# Altium project Leningrad.PrjPcb (part 1 of 2)
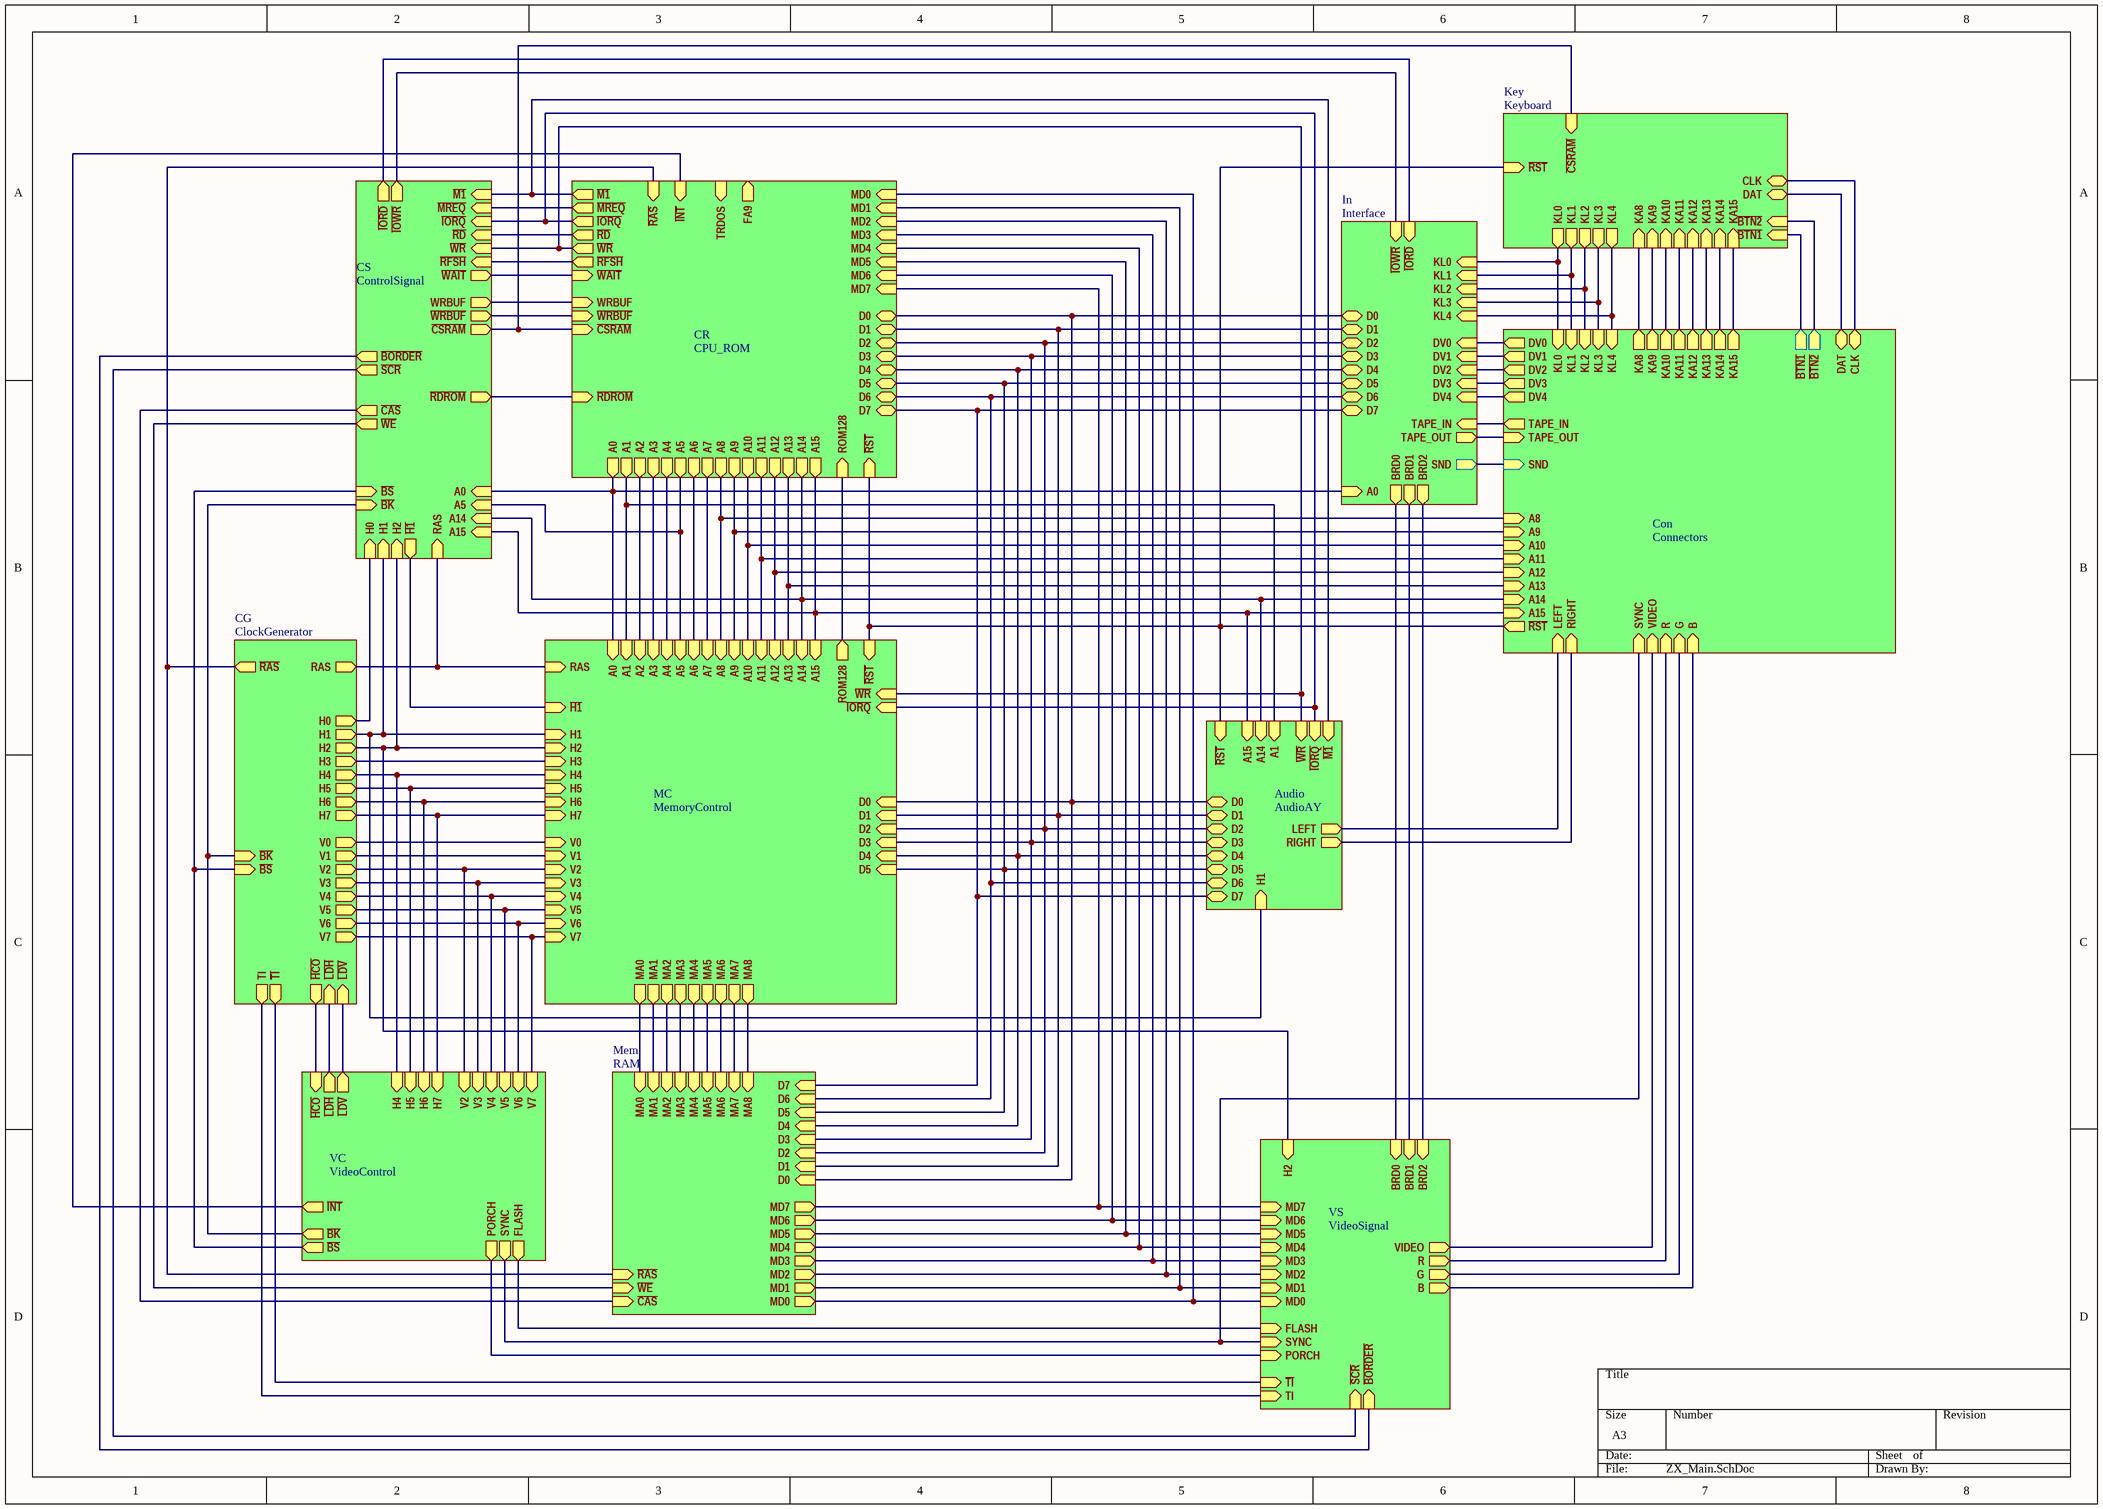
[diagram p0: ZX_Main.SchDoc]
12 sheets, 250 parts. Net scope: hierarchical (ports join the sheet entries above them; power ports are global).
Board file: Leningrad_modify.PcbDoc
Sheets:
  ZX_Main.SchDoc
    CG = ClockGenerator.SchDoc
    CS = ControlSignal.SchDoc
    VC = VideoControl.SchDoc
    VS = VideoSignal.SchDoc
    CR = CPU_ROM.SchDoc
    MC = MemoryControl.SchDoc
    Mem = RAM.SchDoc
    Key = Keyboard.SchDoc
    Audio = AudioAY.SchDoc
    In = Interface.SchDoc
    Con = Connectors.SchDoc

## Sheet ZX_Main.SchDoc
size A3

### Sub-sheets
Audio = AudioAY: A15 (in), ~{IORQ} (in), ~{WR} (in), A14 (in), A1 (in), ~{M1} (in), D5 (bidir), D0 (bidir), D6 (bidir), D7 (bidir), D4 (bidir), D3 (bidir), D2 (bidir), D1 (bidir), H1 (in), ~{RST} (in), RIGHT (out), LEFT (out)
CG = ClockGenerator: TI (out), H5 (out), ~{HCO} (out), V5 (out), V4 (out), V7 (out), V0 (out), H2 (out), H0 (out), ~{LDH} (in), H7 (out), ~{RAS} (out), V3 (out), H1 (out), H3 (out), V2 (out), V6 (out), ~{TI} (out), H6 (out), H4 (out), ~{LDV} (in), RAS (out), ~{BK} (in), ~{BS} (in), V1 (out)
Con = Connectors: VIDEO (in), B (in), G (in), R (in), KA14 (out), SYNC (in), ~{RST} (out), LEFT (in), RIGHT (in), DAT (bidir), CLK (bidir), TAPE_IN (out), TAPE_OUT (in), KA15 (out), KA10 (out), KA12 (out), KA11 (out), KA13 (out), KA9 (out), A9 (in), A15 (in), A8 (in), A13 (in), A14 (in), A12 (in), A11 (in), A10 (in), KA8 (out), DV0 (out), DV1 (out), DV4 (out), DV3 (out), DV2 (out), ~{BTN1} (out), ~{BTN2} (out), KL0 (in), KL4 (in), KL1 (in), KL3 (in), KL2 (in), SND (in)
CR = CPU_ROM: ~{RD} (out), ~{WAIT} (in), A0 (out), ~{RDROM} (in), ~{RAS} (in), ~{M1} (out), ~{INT} (in), ~{RFSH} (out), ~{WR} (out), ~{MREQ} (out), ~{RST} (in), MD7 (in), MD6 (in), MD5 (in), MD4 (in), MD3 (in), MD2 (in), MD1 (in), MD0 (in), ~{WRBUF} (in), WRBUF (in), ~{CSRAM} (in), FA9 (out), ~{IORQ} (out), TRDOS (in), ROM128 (in), D7 (bidir), D6 (bidir), D5 (bidir), D4 (bidir), D3 (bidir), D2 (bidir), D1 (bidir), D0 (bidir), A15 (out), A14 (out), A13 (out), A12 (out), A11 (out), A10 (out), A9 (out), A8 (out), A7 (out), A6 (out), A2 (out), A1 (out), A5 (out), A4 (out), A3 (out)
CS = ControlSignal: ~{BS} (in), ~{BK} (in), H0 (in), H1 (in), H2 (in), ~{BORDER} (out), ~{SCR} (out), ~{CAS} (out), ~{WRBUF} (out), WRBUF (out), ~{RD} (in), ~{RFSH} (in), RAS (in), ~{H1} (out), ~{MREQ} (in), A14 (in), A15 (in), ~{WE} (out), ~{RDROM} (out), ~{CSRAM} (out), ~{M1} (in), ~{WAIT} (out), A0 (in), A5 (in), ~{IORQ} (in), ~{WR} (in), ~{IORD} (out), ~{IOWR} (out)
In = Interface: A0 (in), ~{IORD} (in), KL0 (in), KL1 (in), KL2 (in), KL3 (in), KL4 (in), DV0 (in), DV1 (in), DV2 (in), D0, D1, D2, DV3 (in), DV4 (in), D3, D4, D5, D6, D7, ~{IOWR} (in), BRD0 (out), BRD1 (out), BRD2 (out), TAPE_IN (in), TAPE_OUT (out), SND (out)
Key = Keyboard: KA13 (in), ~{CSRAM} (in), KA15 (in), KL2 (out), ~{RST} (in), KA12 (in), KL3 (out), KA14 (in), KL4 (out), KA8 (in), KA11 (in), CLK (bidir), ~{BTN1} (in), KA10 (in), KA9 (in), DAT (bidir), ~{BTN2} (in), KL0 (out), KL1 (out)
MC = MemoryControl: MA1 (out), MA0 (out), MA8 (out), V4 (in), MA4 (out), MA3 (out), RAS (in), V2 (in), ~{H1} (in), MA7 (out), A1 (in), H5 (in), V1 (in), H1 (in), H2 (in), V3 (in), MA6 (out), V0 (in), MA5 (out), V7 (in), V6 (in), H6 (in), MA2 (out), V5 (in), A0 (in), H7 (in), H4 (in), H3 (in), A2 (in), A3 (in), A4 (in), A5 (in), A6 (in), A7 (in), A8 (in), A9 (in), A10 (in), A11 (in), A12 (in), A13 (in), A14 (in), A15 (in), ~{RST} (in), D0 (in), D1 (in), D2 (in), D3 (in), D4 (in), D5 (in), ~{WR} (in), ~{IORQ} (in), ROM128 (out)
Mem = RAM: D6 (in), D1 (in), D0 (in), MD0 (out), D4 (in), MD7 (out), D7 (in), D5 (in), MD3 (out), MD1 (out), D2 (in), D3 (in), MD2 (out), MD4 (out), MD5 (out), MD6 (out), ~{WE} (in), ~{CAS} (in), ~{RAS} (in), MA8 (in), MA7 (in), MA6 (in), MA5 (in), MA4 (in), MA2 (in), MA1 (in), MA0 (in), MA3 (in)
VC = VideoControl: H7 (in), H6 (in), H5 (in), ~{HCO} (in), ~{LDH} (out), ~{BS} (out), PORCH (out), SYNC (out), V4 (in), V7 (in), ~{LDV} (out), H4 (in), V5 (in), V6 (in), V2 (in), V3 (in), ~{BK} (out), FLASH (out), ~{INT} (out)
VS = VideoSignal: H2 (in), MD6 (in), SYNC (in), MD5 (in), MD3 (in), MD1 (in), TI (in), ~{SCR} (in), FLASH (in), ~{TI} (in), MD0 (in), MD2 (in), MD4 (in), PORCH (in), ~{BORDER} (in), MD7 (in), G (out), R (out), B (out), VIDEO (out), BRD2 (in), BRD1 (in), BRD0 (in)

### Nets
A0: sheet CS/A0, sheet CR/A0, sheet MC/A0, sheet In/A0
A1: sheet CR/A1, sheet MC/A1, sheet Audio/A1
A2: sheet CR/A2, sheet MC/A2
A3: sheet CR/A3, sheet MC/A3
A4: sheet CR/A4, sheet MC/A4
A5: sheet CS/A5, sheet CR/A5, sheet MC/A5
A6: sheet CR/A6, sheet MC/A6
A7: sheet CR/A7, sheet MC/A7
A8: sheet CR/A8, sheet MC/A8, sheet Con/A8
A9: sheet CR/A9, sheet MC/A9, sheet Con/A9
A10: sheet CR/A10, sheet MC/A10, sheet Con/A10
A11: sheet CR/A11, sheet MC/A11, sheet Con/A11
A12: sheet CR/A12, sheet MC/A12, sheet Con/A12
A13: sheet CR/A13, sheet MC/A13, sheet Con/A13
A14: sheet CS/A14, sheet CR/A14, sheet MC/A14, sheet Audio/A14, sheet Con/A14
A15: sheet CS/A15, sheet CR/A15, sheet MC/A15, sheet Audio/A15, sheet Con/A15
~{BORDER}: sheet CS/~{BORDER}, sheet VS/~{BORDER}
BRD0: sheet VS/BRD0, sheet In/BRD0
BRD1: sheet VS/BRD1, sheet In/BRD1
BRD2: sheet VS/BRD2, sheet In/BRD2
~{CAS}: sheet CS/~{CAS}, sheet Mem/~{CAS}
D0: sheet CR/D0, sheet MC/D0, sheet Mem/D0, sheet Audio/D0, sheet In/D0
D1: sheet CR/D1, sheet MC/D1, sheet Mem/D1, sheet Audio/D1, sheet In/D1
D2: sheet CR/D2, sheet MC/D2, sheet Mem/D2, sheet Audio/D2, sheet In/D2
D3: sheet CR/D3, sheet MC/D3, sheet Mem/D3, sheet Audio/D3, sheet In/D3
D4: sheet CR/D4, sheet MC/D4, sheet Mem/D4, sheet Audio/D4, sheet In/D4
D5: sheet CR/D5, sheet MC/D5, sheet Mem/D5, sheet Audio/D5, sheet In/D5
D6: sheet CR/D6, sheet Mem/D6, sheet Audio/D6, sheet In/D6
D7: sheet CR/D7, sheet Mem/D7, sheet Audio/D7, sheet In/D7
DV0: sheet In/DV0, sheet Con/DV0
DV1: sheet In/DV1, sheet Con/DV1
DV2: sheet In/DV2, sheet Con/DV2
DV3: sheet In/DV3, sheet Con/DV3
DV4: sheet In/DV4, sheet Con/DV4
H0: sheet CG/H0, sheet CS/H0
H1: sheet CG/H1, sheet CS/H1, sheet MC/H1, sheet Audio/H1
H2: sheet CG/H2, sheet CS/H2, sheet VS/H2, sheet MC/H2
H5: sheet CG/H5, sheet VC/H5, sheet MC/H5
~{H1}: sheet CS/~{H1}, sheet MC/~{H1}
~{IORD}: sheet CS/~{IORD}, sheet In/~{IORD}
KL0: sheet Key/KL0, sheet In/KL0, sheet Con/KL0
KL1: sheet Key/KL1, sheet In/KL1, sheet Con/KL1
KL2: sheet Key/KL2, sheet In/KL2, sheet Con/KL2
KL3: sheet Key/KL3, sheet In/KL3, sheet Con/KL3
KL4: sheet Key/KL4, sheet In/KL4, sheet Con/KL4
~{MREQ}: sheet CS/~{MREQ}, sheet CR/~{MREQ}
MA0: sheet MC/MA0, sheet Mem/MA0
MA1: sheet MC/MA1, sheet Mem/MA1
MA2: sheet MC/MA2, sheet Mem/MA2
MA3: sheet MC/MA3, sheet Mem/MA3
MA4: sheet MC/MA4, sheet Mem/MA4
MA5: sheet MC/MA5, sheet Mem/MA5
MA6: sheet MC/MA6, sheet Mem/MA6
MA7: sheet MC/MA7, sheet Mem/MA7
MA8: sheet MC/MA8, sheet Mem/MA8
MD0: sheet VS/MD0, sheet CR/MD0, sheet Mem/MD0
MD1: sheet VS/MD1, sheet CR/MD1, sheet Mem/MD1
MD2: sheet VS/MD2, sheet CR/MD2, sheet Mem/MD2
MD3: sheet VS/MD3, sheet CR/MD3, sheet Mem/MD3
MD4: sheet VS/MD4, sheet CR/MD4, sheet Mem/MD4
MD5: sheet VS/MD5, sheet CR/MD5, sheet Mem/MD5
MD6: sheet VS/MD6, sheet CR/MD6, sheet Mem/MD6
MD7: sheet VS/MD7, sheet CR/MD7, sheet Mem/MD7
~{RAS}: sheet CG/~{RAS}, sheet CR/~{RAS}, sheet Mem/~{RAS}
~{RD}: sheet CS/~{RD}, sheet CR/~{RD}
RAS: sheet CG/RAS, sheet CS/RAS, sheet MC/RAS
V4: sheet CG/V4, sheet VC/V4, sheet MC/V4
V5: sheet CG/V5, sheet VC/V5, sheet MC/V5
V6: sheet CG/V6, sheet VC/V6, sheet MC/V6
~{WE}: sheet CS/~{WE}, sheet Mem/~{WE}
~{WR}: sheet CS/~{WR}, sheet CR/~{WR}, sheet MC/~{WR}, sheet Audio/~{WR}
~{WRBUF}: sheet CS/~{WRBUF}, sheet CR/~{WRBUF}
NetB_1: sheet VS/B, sheet Con/B
NetBTN1_1: sheet Key/~{BTN1}, sheet Con/~{BTN1}
NetBTN2_1: sheet Key/~{BTN2}, sheet Con/~{BTN2}
NetC1_1: sheet CR/~{RST}, sheet MC/~{RST}, sheet Key/~{RST}, sheet Audio/~{RST}, sheet Con/~{RST}
NetC10_2: sheet CG/~{HCO}, sheet VC/~{HCO}
NetC11_1: sheet CG/~{LDV}, sheet VC/~{LDV}
NetC12_2: sheet CG/~{BS}, sheet CS/~{BS}, sheet VC/~{BS}
NetC24_1: sheet In/TAPE_OUT, sheet Con/TAPE_OUT
NetC46_1: sheet In/TAPE_IN, sheet Con/TAPE_IN
NetC52_2: sheet Audio/LEFT, sheet Con/LEFT
NetC53_2: sheet Audio/RIGHT, sheet Con/RIGHT
NetD2_2: sheet VC/FLASH, sheet VS/FLASH
NetD4_2: sheet VC/SYNC, sheet VS/SYNC, sheet Con/SYNC
NetD10_1: sheet Key/KA8, sheet Con/KA8
NetD11_1: sheet Key/KA9, sheet Con/KA9
NetD12_1: sheet Key/KA10, sheet Con/KA10
NetD13_1: sheet Key/KA11, sheet Con/KA11
NetD14_1: sheet Key/KA12, sheet Con/KA12
NetD15_1: sheet Key/KA13, sheet Con/KA13
NetD16_1: sheet Key/KA14, sheet Con/KA14
NetD17_1: sheet Key/KA15, sheet Con/KA15
NetG_1: sheet VS/G, sheet Con/G
NetJ6_2: sheet CS/~{IOWR}, sheet In/~{IOWR}
NetJ8_3: sheet VS/VIDEO, sheet Con/VIDEO
NetJ11_1: sheet CS/WRBUF, sheet CR/WRBUF
NetJ14_2: sheet CS/~{IORQ}, sheet CR/~{IORQ}, sheet MC/~{IORQ}, sheet Audio/~{IORQ}
NetJ27_1: sheet CG/H7, sheet VC/H7, sheet MC/H7
NetJ28_2: sheet VC/PORCH, sheet VS/PORCH
NetQ1_2: sheet In/SND, sheet Con/SND
NetR25_2: sheet CS/~{SCR}, sheet VS/~{SCR}
NetR_1: sheet VS/R, sheet Con/R
NetU1_9: sheet CS/~{CSRAM}, sheet CR/~{CSRAM}, sheet Key/~{CSRAM}
NetU1_12: sheet VC/~{INT}, sheet CR/~{INT}
NetU2_2: sheet CG/~{TI}, sheet VS/~{TI}
NetU2_5: sheet CG/TI, sheet VS/TI
NetU3_7: sheet CG/H3, sheet MC/H3
NetU4_3: sheet CG/H4, sheet VC/H4, sheet MC/H4
NetU4_6: sheet CG/H6, sheet VC/H6, sheet MC/H6
NetU4_11: sheet CG/~{LDH}, sheet VC/~{LDH}
NetU5_2: sheet CG/V1, sheet MC/V1
NetU5_3: sheet CG/V0, sheet MC/V0
NetU5_6: sheet CG/V2, sheet VC/V2, sheet MC/V2
NetU5_7: sheet CG/V3, sheet VC/V3, sheet MC/V3
NetU5_9: sheet CG/~{BK}, sheet CS/~{BK}, sheet VC/~{BK}
NetU6_7: sheet CG/V7, sheet VC/V7, sheet MC/V7
NetU9_2: sheet CS/~{M1}, sheet CR/~{M1}, sheet Audio/~{M1}
NetU9_5: sheet CS/~{WAIT}, sheet CR/~{WAIT}
NetU12_3: sheet CS/~{RDROM}, sheet CR/~{RDROM}
NetU12_13: sheet CS/~{RFSH}, sheet CR/~{RFSH}
NetU34_9: sheet CR/ROM128, sheet MC/ROM128
NetU43_27: sheet Key/DAT, sheet Con/DAT
NetU43_28: sheet Key/CLK, sheet Con/CLK

## Sheet ClockGenerator.SchDoc
size A4
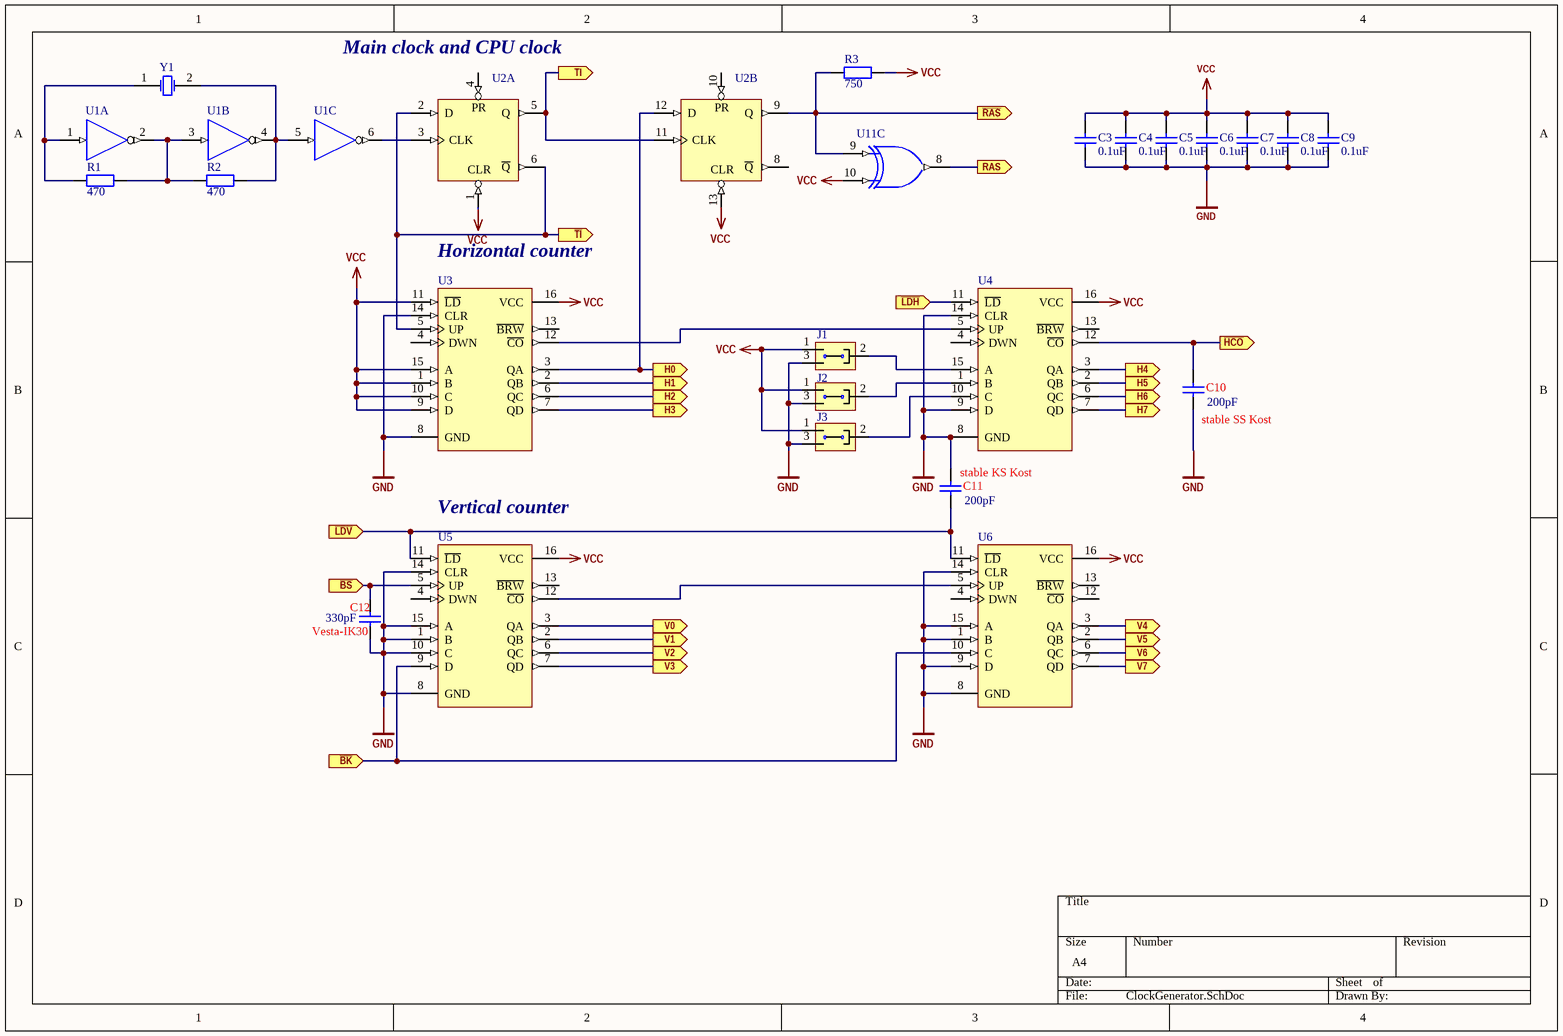
[diagram p1: ClockGenerator.SchDoc]

### Parts
C3  value 0.1uF  [RAD-0.3]  (hidden comment: Cap)
C4  value 0.1uF  [RAD-0.3]  (hidden comment: Cap)
C5  value 0.1uF  [RAD-0.3]  (hidden comment: Cap)
C6  value 0.1uF  [RAD-0.3]  (hidden comment: Cap)
C7  value 0.1uF  [RAD-0.3]  (hidden comment: Cap)
C8  value 0.1uF  [RAD-0.3]  (hidden comment: Cap)
C9  value 0.1uF  [RAD-0.3]  (hidden comment: Cap)
C10  stable SS Kost  value 200pF  [RAD-0.3]
C11  stable KS Kost  value 200pF  [RAD-0.3]
C12  Vesta-IK30  value 330pF  [RAD-0.3]
J1  Jump3  [MHDR1X3]  (value not drawn)
J2  Jump3  [MHDR1X3]  (value not drawn)
J3  Jump3  [MHDR1X3]  (value not drawn)
R1  value 470  [AXIAL-0.4]
R2  value 470  [AXIAL-0.4]
R3  value 750  [AXIAL-0.4]
U1  (no value)  [N014]  (parts A,B,C of 6)
U2  (no value)  [N014]  (parts A,B of 2)
U3  (no value)  [N016]
U4  (no value)  [N016]
U5  (no value)  [N016]
U6  (no value)  [N016]
U11  (no value)  [N014]  (part C of 4)
Y1  XTAL  [HC25U]  (value not drawn)

### Ports
H0 (out), H1 (out), H2 (out), H3 (out), H4 (out), H5 (out), H6 (out), H7 (out), RAS (out), TI (out), V0 (out), V1 (out), V2 (out), V3 (out), V4 (out), V5 (out), V6 (out), V7 (out), ~{BK} (in), ~{BS} (in), ~{HCO} (out), ~{LDH} (in), ~{LDV} (in), ~{RAS} (out), ~{TI} (out)

### Nets
GND: C3.1 C4.1 C5.1 C6.1 C7.1 C8.1 C9.1 C10.1 C11.2 C12.1 J1.3 J2.3 J3.3 U1.7(GND) U2.7(GND) U3.8(GND) U3.14(CLR) U4.8(GND) U4.9(D) U4.14(CLR) U5.1(B) U5.8(GND) U5.10(C) U5.14(CLR) U5.15(A) U6.1(B) U6.8(GND) U6.9(D) U6.14(CLR) U6.15(A) U11.7(GND)
VCC: C3.2 C4.2 C5.2 C6.2 C7.2 C8.2 C9.2 J1.1 J2.1 J3.1 R3.2 U1.14(VCC) U2.1(CLR) U2.13(CLR) U2.14(VCC) U3.1(B) U3.9(D) U3.10(C) U3.11(~{LD}) U3.15(A) U3.16(VCC) U4.16(VCC) U5.16(VCC) U6.16(VCC) U11.10(B) U11.14(VCC)
H0: U2.12(D) U3.3(QA) ; port H0
H1: U3.2(QB) ; port H1
H2: U3.6(QC) ; port H2
H5: U4.2(QB) ; port H5
~{RAS}: R3.1 U2.9(Q) U11.9(A) ; port ~{RAS}
RAS: U11.8(Y) ; port RAS
V4: U6.3(QA) ; port V4
V5: U6.2(QB) ; port V5
V6: U6.6(QC) ; port V6
NetC10_2: C10.2 U4.12(~{CO}) ; port ~{HCO}
NetC11_1: C11.1 U5.11(~{LD}) U6.11(~{LD}) ; port ~{LDV}
NetC12_2: C12.2 U5.5(UP) ; port ~{BS}
NetJ1_2: J1.2 U4.15(A)
NetJ2_2: J2.2 U4.1(B)
NetJ3_2: J3.2 U4.10(C)
NetJ27_1: U4.7(QD) ; port H7
NetR1_1: R1.1 U1.1(A) Y1.1(OSC1)
NetR1_2: R1.2 R2.1 U1.2(Y) U1.3(A)
NetR2_2: R2.2 U1.4(Y) U1.5(A) Y1.2(OSC2)
NetU1_6: U1.6(Y) U2.3(CLK)
NetU2_2: U2.2(D) U2.6(~{Q}) U3.5(UP) ; port ~{TI}
NetU2_5: U2.5(Q) U2.11(CLK) ; port TI
NetU3_7: U3.7(QD) ; port H3
NetU3_12: U3.12(~{CO}) U4.5(UP)
NetU4_3: U4.3(QA) ; port H4
NetU4_6: U4.6(QC) ; port H6
NetU4_11: U4.11(~{LD}) ; port ~{LDH}
NetU5_2: U5.2(QB) ; port V1
NetU5_3: U5.3(QA) ; port V0
NetU5_6: U5.6(QC) ; port V2
NetU5_7: U5.7(QD) ; port V3
NetU5_9: U5.9(D) U6.10(C) ; port ~{BK}
NetU5_12: U5.12(~{CO}) U6.5(UP)
NetU6_7: U6.7(QD) ; port V7

Not connected (* = marked no-connect by the designer): U2 4(PR) 8(~{Q}) 10(PR); U3 4(DWN) 13(~{BRW}); U4 4(DWN) 13(~{BRW}); U5 4(DWN) 13(~{BRW}); U6 4(DWN) 12(~{CO}) 13(~{BRW})

### Notes on the sheet
- (near U2) Main clock and CPU clock
- Horizontal counter
- Vertical counter

### Library data of the parts
C3-C12 = Cap: Capacitor; Published: 8-Jun-2000; LatestRevisionDate: 17-Jul-2002; LatestRevisionNote: Re-released for DXP Platform.; PackageReference: RAD-0.3; Publisher: Altium Limited; PackageDescription: Radial Cap, Thru-Hole; 2 Leads; 0.3 in Pin Spacing
R1-R3 = Res2: Resistor; Published: 8-Jun-2000; LatestRevisionDate: 17-Jul-2002; LatestRevisionNote: Re-released for DXP Platform.; PackageReference: AXIAL-0.4; Publisher: Altium Limited; PackageDescription: Axial Device, Thru-Hole; 2 Leads; 0.4 in Pin Spacing
U1 = SN74HC04N: Hex Inverter; Published: 8-Jun-2000; LatestRevisionDate: 04-Mar-2005; LatestRevisionNote: Stylized 3D Model Added.; DatasheetVersion: May-1997; PackageVersion: Oct-1995; PackageReference: N014; Publisher: Altium Limited; PackageDescription: DIP; 14 Leads; Row Spacing 7.62 mm; Pitch 2.54 mm; ComponentLink1Description: Manufacturer Link; ComponentLink1URL: http://www.ti.com/; ComponentLink2Description: Datasheet; ComponentLink2URL: http://www-s.ti.com/sc/ds/sn74hc04.pdf
U2 = SN74HC74N: Dual D-Type Positive-Edge-Triggered Flip-Flop with Clear and Preset; Published: 8-Jun-2000; LatestRevisionDate: 04-Mar-2005; LatestRevisionNote: Stylized 3D Model Added.; DatasheetVersion: May-1997; PackageVersion: Oct-1995; PackageReference: N014; Publisher: Altium Limited; PackageDescription: DIP; 14 Leads; Row Spacing 7.62 mm; Pitch 2.54 mm; ComponentLink1Description: Manufacturer Link; ComponentLink1URL: http://www.ti.com/; ComponentLink2Description: Datasheet; ComponentLink2URL: http://www-s.ti.com/sc/ds/sn74hc74.pdf
U3-U6 = SN74HC193N: 4-Bit Synchronous Up/Down Counter (Dual Clock with Clear); Published: 8-Jun-2000; LatestRevisionDate: 04-Mar-2005; LatestRevisionNote: Stylized 3D Model Added.; DatasheetVersion: May-1997; PackageVersion: Oct-1995; PackageReference: N016; Publisher: Altium Limited; PackageDescription: DIP; 16 Leads; Row Spacing 7.62 mm; Pitch 2.54 mm; Code_JEDEC: MS-001-BB; ComponentLink1Description: Manufacturer Link; ComponentLink1URL: http://www.ti.com/; ComponentLink2Description: Datasheet; ComponentLink2URL: http://www-s.ti.com/sc/ds/sn74hc193.pdf
U11 = SN74HC86N: Quadruple 2-Input Exclusive-OR Gate; Published: 8-Jun-2000; LatestRevisionDate: 04-Mar-2005; LatestRevisionNote: Stylized 3D Model Added.; DatasheetVersion: Aug-1999; PackageVersion: Oct-1995; PackageReference: N014; Publisher: Altium Limited; PackageDescription: DIP; 14 Leads; Row Spacing 7.62 mm; Pitch 2.54 mm; ComponentLink1Description: Manufacturer Link; ComponentLink1URL: http://www.ti.com/; ComponentLink2Description: Datasheet; ComponentLink2URL: http://www-s.ti.com/sc/ds/SN54HC86.pdf
Y1 = XTAL: Crystal Oscillator; Published: 8-Jun-2000; LatestRevisionDate: 17-Jul-2002; LatestRevisionNote: Re-released for DXP Platform.; PackageReference: R38; Publisher: Altium Limited; PackageDescription: Crystal, Thru-Hole; 2 Leads; Body 3.1 x 8.2 mm (Dia.xH)

## Sheet ControlSignal.SchDoc
size A4
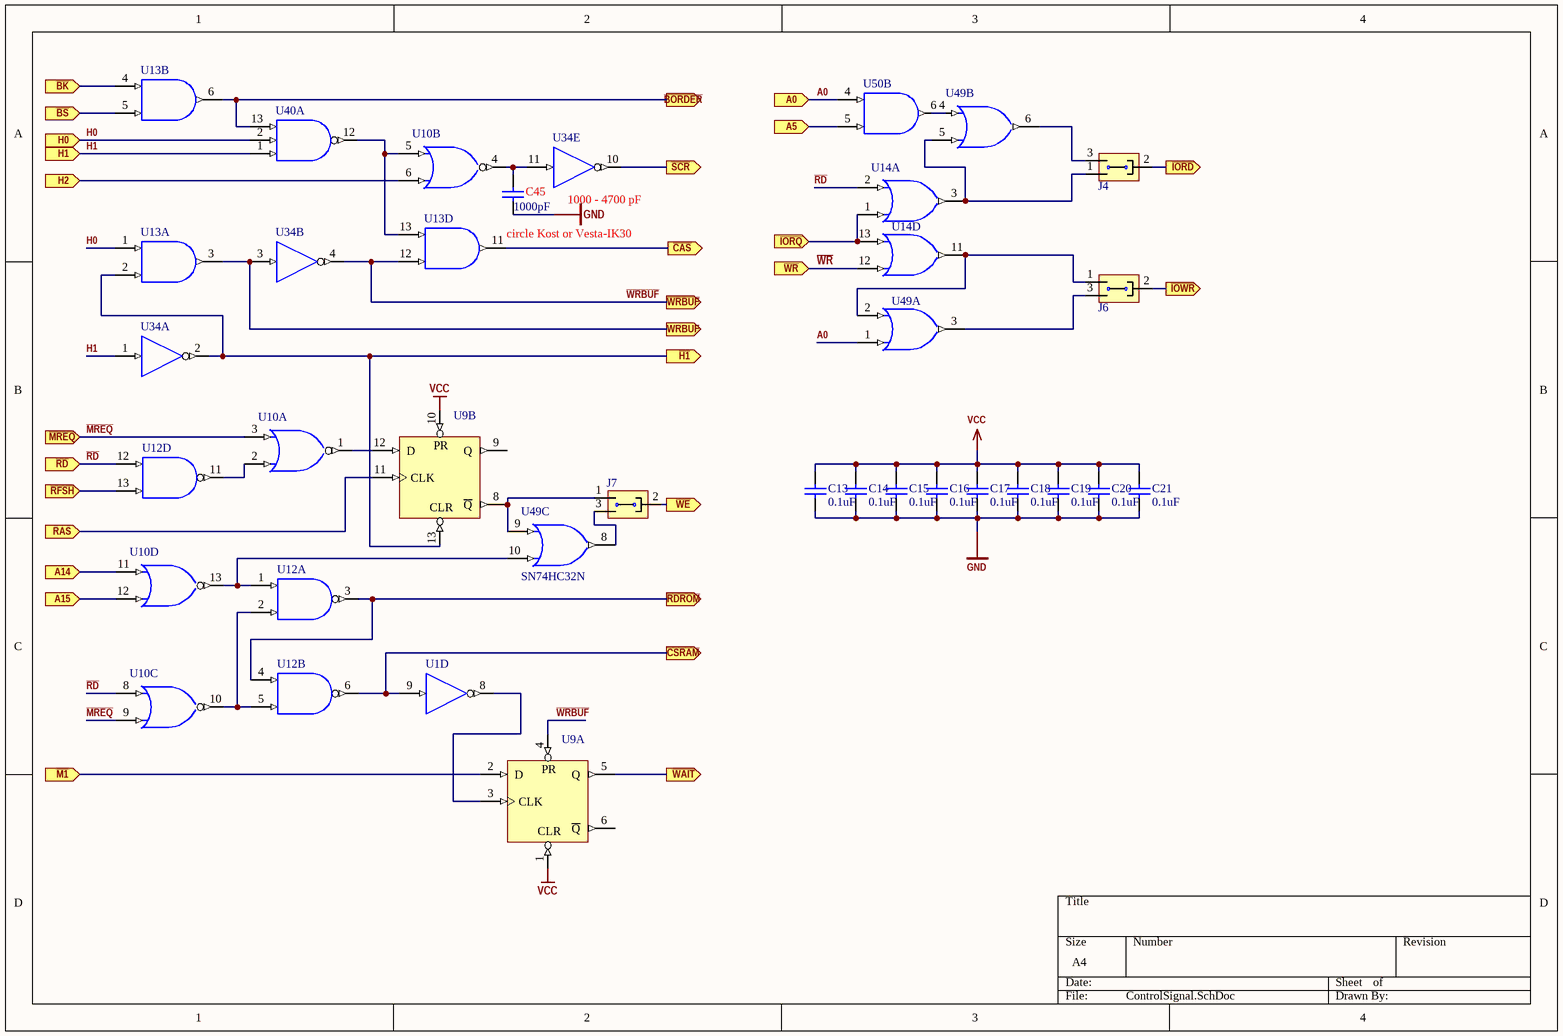
[diagram p2: ControlSignal.SchDoc]

### Parts
C13  value 0.1uF  [RAD-0.3]  (hidden comment: Cap)
C14  value 0.1uF  [RAD-0.3]  (hidden comment: Cap)
C15  value 0.1uF  [RAD-0.3]  (hidden comment: Cap)
C16  value 0.1uF  [RAD-0.3]  (hidden comment: Cap)
C17  value 0.1uF  [RAD-0.3]  (hidden comment: Cap)
C18  value 0.1uF  [RAD-0.3]  (hidden comment: Cap)
C19  value 0.1uF  [RAD-0.3]  (hidden comment: Cap)
C20  value 0.1uF  [RAD-0.3]  (hidden comment: Cap)
C21  value 0.1uF  [RAD-0.3]  (hidden comment: Cap)
C45  circle Kost or Vesta-IK30  value 1000pF  [RAD-0.3]
J4  Jump3  [MHDR1X3]  (value not drawn)
J6  Jump3  [MHDR1X3]  (value not drawn)
J7  Jump3  [MHDR1X3]  (value not drawn)
U1  (no value)  [N014]  (part D of 6)
U9  (no value)  [N014]  (parts A,B of 2)
U10  (no value)  [N014]  (parts A,B,C,D of 4)
U12  (no value)  [N014]  (parts A,B,D of 4)
U13  (no value)  [N014]  (parts A,B,D of 4)
U14  (no value)  [N014]  (parts A,D of 4)
U34  (no value)  [N014]  (parts A,B,E of 6)
U40  (no value)  [N014]  (part A of 3)
U49  SN74HC32N  [N014]  (value not drawn)  (parts A,B,C of 4)
U50  SN74HC08N  [N014]  (value not drawn)  (part B of 4)

### Ports
A0 (in), A5 (in), A14 (in), A15 (in), H0 (in), H1 (in), H2 (in), RAS (in), WRBUF (out), ~{BK} (in), ~{BORDER} (out), ~{BS} (in), ~{CAS} (out), ~{CSRAM} (out), ~{H1} (out), ~{IORD} (out), ~{IORQ} (in), ~{IOWR} (out), ~{M1} (in), ~{MREQ} (in), ~{RDROM} (out), ~{RD} (in), ~{RFSH} (in), ~{SCR} (out), ~{WAIT} (out), ~{WE} (out), ~{WRBUF} (out), ~{WR} (in)

### Nets
GND: C13.1 C14.1 C15.1 C16.1 C17.1 C18.1 C19.1 C20.1 C21.1 C45.1 U1.7(GND) U9.7(GND) U10.7(GND) U12.7(GND) U13.7(GND) U14.7(GND) U34.7(GND) U40.7(GND) U49.7(GND) U50.7(GND)
VCC: C13.2 C14.2 C15.2 C16.2 C17.2 C18.2 C19.2 C20.2 C21.2 U1.14(VCC) U9.1(CLR) U9.10(PR) U9.14(VCC) U10.14(VCC) U12.14(VCC) U13.14(VCC) U14.14(VCC) U34.14(VCC) U40.14(VCC) U49.14(VCC) U50.14(VCC)
A0: U49.1(A) U50.4(A) ; port A0
A5: U50.5(B) ; port A5
A14: U10.11(A) ; port A14
A15: U10.12(B) ; port A15
~{BORDER}: U13.6(Y) U40.13(C) ; port ~{BORDER}
~{CAS}: U13.11(Y) ; port ~{CAS}
H0: U13.1(A) U40.2(B) ; port H0
H1: U34.1(A) U40.1(A) ; port H1
H2: U10.6(B) ; port H2
~{H1}: U9.13(CLR) U13.2(B) U34.2(Y) ; port ~{H1}
~{IORD}: J4.2 ; port ~{IORD}
~{MREQ}: U10.3(B) U10.9(B) ; port ~{MREQ}
~{RD}: U10.8(A) U12.12(A) U14.2(B) ; port ~{RD}
RAS: U9.11(CLK) ; port RAS
~{WE}: J7.2 ; port ~{WE}
~{WR}: U14.12(A) ; port ~{WR}
~{WRBUF}: U9.4(PR) U13.12(A) U34.4(Y) ; port ~{WRBUF}
NetC12_2: U13.5(B) ; port ~{BS}
NetC45_2: C45.2 U10.4(Y) U34.11(A)
NetJ4_1: J4.1 U14.3(Y) U49.5(B)
NetJ4_3: J4.3 U49.6(Y)
NetJ6_1: J6.1 U14.11(Y) U49.2(B)
NetJ6_2: J6.2 ; port ~{IOWR}
NetJ6_3: J6.3 U49.3(Y)
NetJ7_1: J7.1 U9.8(~{Q}) U49.9(A)
NetJ7_3: J7.3 U49.8(Y)
NetJ11_1: U13.3(Y) U34.3(A) ; port WRBUF
NetJ14_2: U14.1(A) U14.13(B) ; port ~{IORQ}
NetR25_2: U34.10(Y) ; port ~{SCR}
NetU1_8: U1.8(Y) U9.3(CLK)
NetU1_9: U1.9(A) U12.6(Y) ; port ~{CSRAM}
NetU5_9: U13.4(A) ; port ~{BK}
NetU9_2: U9.2(D) ; port ~{M1}
NetU9_5: U9.5(Q) ; port ~{WAIT}
NetU9_12: U9.12(D) U10.1(Y)
NetU10_2: U10.2(A) U12.11(Y)
NetU10_5: U10.5(A) U13.13(B) U40.12(Y)
NetU10_10: U10.10(Y) U12.2(B) U12.5(B)
NetU10_13: U10.13(Y) U12.1(A) U49.10(B)
NetU12_3: U12.3(Y) U12.4(A) ; port ~{RDROM}
NetU12_13: U12.13(B) ; port ~{RFSH}
NetU49_4: U49.4(A) U50.6(Y)

Not connected (* = marked no-connect by the designer): U9 6(~{Q}) 9(Q)

### Notes on the sheet
- (near U34) 1000 - 4700 pF

### Library data of the parts
C13-C21 C45 = Cap: Capacitor; Published: 8-Jun-2000; LatestRevisionDate: 17-Jul-2002; LatestRevisionNote: Re-released for DXP Platform.; PackageReference: RAD-0.3; Publisher: Altium Limited; PackageDescription: Radial Cap, Thru-Hole; 2 Leads; 0.3 in Pin Spacing
U1 U34 = SN74HC04N: Hex Inverter; Published: 8-Jun-2000; LatestRevisionDate: 04-Mar-2005; LatestRevisionNote: Stylized 3D Model Added.; DatasheetVersion: May-1997; PackageVersion: Oct-1995; PackageReference: N014; Publisher: Altium Limited; PackageDescription: DIP; 14 Leads; Row Spacing 7.62 mm; Pitch 2.54 mm; ComponentLink1Description: Manufacturer Link; ComponentLink1URL: http://www.ti.com/; ComponentLink2Description: Datasheet; ComponentLink2URL: http://www-s.ti.com/sc/ds/sn74hc04.pdf
U9 = SN74HC74N: as U2 on sheet ClockGenerator; Published: 8-Jun-2000; LatestRevisionDate: 04-Mar-2005; LatestRevisionNote: Stylized 3D Model Added.; DatasheetVersion: May-1997; PackageVersion: Oct-1995; PackageReference: N014; Publisher: Altium Limited; PackageDescription: DIP; 14 Leads; Row Spacing 7.62 mm; Pitch 2.54 mm; ComponentLink1Description: Manufacturer Link; ComponentLink1URL: http://www.ti.com/; ComponentLink2Description: Datasheet; ComponentLink2URL: http://www-s.ti.com/sc/ds/sn74hc74.pdf
U10 = SN74HC02N: Quadruple 2-Input Positive-NOR Gate; Published: 8-Jun-2000; LatestRevisionDate: 04-Mar-2005; LatestRevisionNote: Stylized 3D Model Added.; DatasheetVersion: May-1997; PackageVersion: Oct-1995; PackageReference: N014; Publisher: Altium Limited; PackageDescription: DIP; 14 Leads; Row Spacing 7.62 mm; Pitch 2.54 mm; ComponentLink1Description: Manufacturer Link; ComponentLink1URL: http://www.ti.com/; ComponentLink2Description: Datasheet; ComponentLink2URL: http://www-s.ti.com/sc/ds/sn74hc02.pdf
U12 = SN74HC00N: Quadruple 2-Input Positive-NAND Gate; Published: 8-Jun-2000; LatestRevisionDate: 04-Mar-2005; LatestRevisionNote: Stylized 3D Model Added.; DatasheetVersion: May-1997; PackageVersion: Oct-1995; PackageReference: N014; Publisher: Altium Limited; PackageDescription: DIP; 14 Leads; Row Spacing 7.62 mm; Pitch 2.54 mm; ComponentLink1Description: Manufacturer Link; ComponentLink1URL: http://www.ti.com/; ComponentLink2Description: Datasheet; ComponentLink2URL: http://www-s.ti.com/sc/ds/sn74hc00.pdf
U13 U50 = SN74HC08N: Quadruple 2-Input Positive-AND Gate; Published: 8-Jun-2000; LatestRevisionDate: 04-Mar-2005; LatestRevisionNote: Stylized 3D Model Added.; DatasheetVersion: May-1997; PackageVersion: Oct-1995; PackageReference: N014; Publisher: Altium Limited; PackageDescription: DIP; 14 Leads; Row Spacing 7.62 mm; Pitch 2.54 mm; ComponentLink1Description: Manufacturer Link; ComponentLink1URL: http://www.ti.com/; ComponentLink2Description: Datasheet; ComponentLink2URL: http://www-s.ti.com/sc/ds/SN74HC08.pdf
U14 U49 = SN74HC32N: Quadruple 2-Input Positive-OR Gate; Published: 8-Jun-2000; LatestRevisionDate: 04-Mar-2005; LatestRevisionNote: Stylized 3D Model Added.; DatasheetVersion: May-1997; PackageVersion: Oct-1995; PackageReference: N014; Publisher: Altium Limited; PackageDescription: DIP; 14 Leads; Row Spacing 7.62 mm; Pitch 2.54 mm; ComponentLink1Description: Manufacturer Link; ComponentLink1URL: http://www.ti.com/; ComponentLink2Description: Datasheet; ComponentLink2URL: http://www-s.ti.com/sc/ds/sn74hc32.pdf
U40 = SN74HC10N: Triple 3-Input Positive-NAND Gate; Published: 8-Jun-2000; LatestRevisionDate: 04-Mar-2005; LatestRevisionNote: Stylized 3D Model Added.; DatasheetVersion: May-1997; PackageVersion: Oct-1995; PackageReference: N014; Publisher: Altium Limited; PackageDescription: DIP; 14 Leads; Row Spacing 7.62 mm; Pitch 2.54 mm; ComponentLink1Description: Manufacturer Link; ComponentLink1URL: http://www.ti.com/; ComponentLink2Description: Datasheet; ComponentLink2URL: http://www-s.ti.com/sc/ds/sn74hc10.pdf

## Sheet VideoControl.SchDoc
size A4
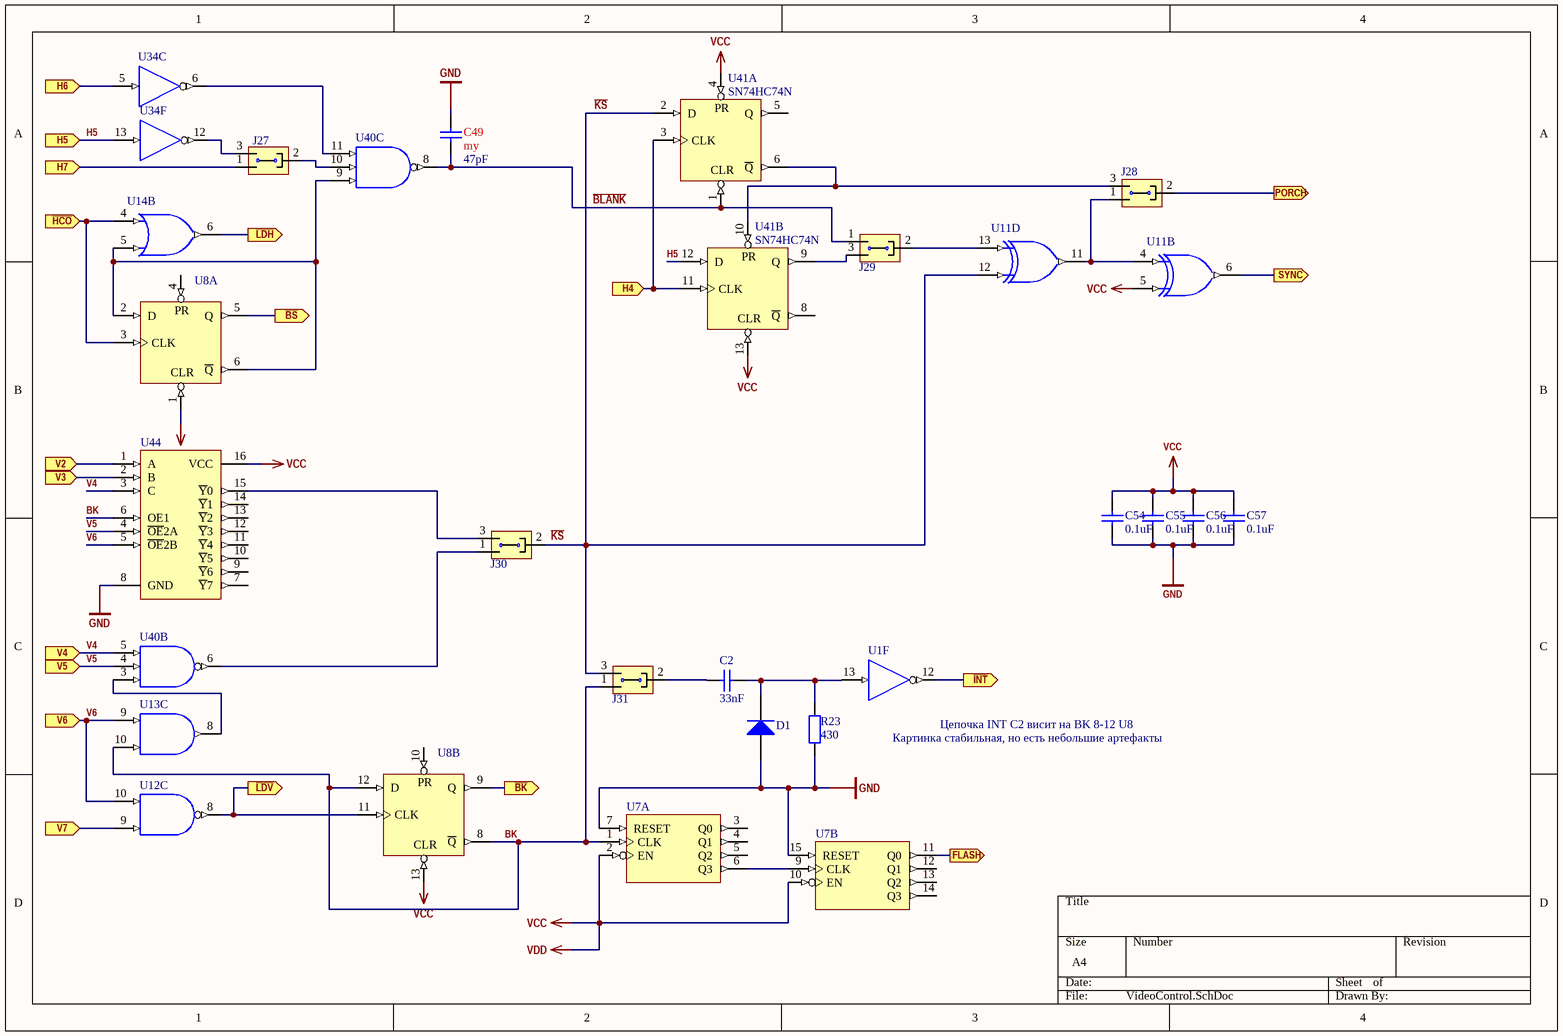
[diagram p3: VideoControl.SchDoc]

### Parts
C2  value 33nF  [RAD-0.3]  (hidden comment: Cap)
C49  my  value 47pF  [RAD-0.3]
C54  value 0.1uF  [RAD-0.3]  (hidden comment: Cap)
C55  value 0.1uF  [RAD-0.3]  (hidden comment: Cap)
C56  value 0.1uF  [RAD-0.3]  (hidden comment: Cap)
C57  value 0.1uF  [RAD-0.3]  (hidden comment: Cap)
D1  Diode 1N4148  [DO-35]  (value not drawn)
J27  Jump3  [MHDR1X3]  (value not drawn)
J28  Jump3  [MHDR1X3]  (value not drawn)
J29  Jump3  [MHDR1X3]  (value not drawn)
J30  Jump3  [MHDR1X3]  (value not drawn)
J31  Jump3  [MHDR1X3]  (value not drawn)
R23  value 430  [AXIAL-0.4]
U1  (no value)  [N014]  (part F of 6)
U7  (no value)  [648-08]  (parts A,B of 2)
U8  (no value)  [N014]  (parts A,B of 2)
U11  (no value)  [N014]  (parts B,D of 4)
U12  (no value)  [N014]  (part C of 4)
U13  (no value)  [N014]  (part C of 4)
U14  (no value)  [N014]  (part B of 4)
U34  (no value)  [N014]  (parts C,F of 6)
U40  (no value)  [N014]  (parts B,C of 3)
U41  SN74HC74N  [N014]  (parts A,B of 2)
U44  (no value)  [N016]

### Ports
FLASH (out), H4 (in), H5 (in), H6 (in), H7 (in), PORCH (out), SYNC (out), V2 (in), V3 (in), V4 (in), V5 (in), V6 (in), V7 (in), ~{BK} (out), ~{BS} (out), ~{HCO} (in), ~{INT} (out), ~{LDH} (out), ~{LDV} (out)

### Nets
GND: C49.1 C54.1 C55.1 C56.1 C57.1 D1.1(A) R23.1 U1.7(GND) U7.7(RESET) U7.8(GND) U7.15(RESET) U8.7(GND) U11.7(GND) U12.7(GND) U13.7(GND) U14.7(GND) U34.7(GND) U40.7(GND) U41.7(GND) U44.8(GND)
VCC: C54.2 C55.2 C56.2 C57.2 U1.14(VCC) U7.2(EN) U7.10(EN) U7.16(VDD) U8.1(CLR) U8.13(CLR) U8.14(VCC) U11.5(B) U11.14(VCC) U12.14(VCC) U13.14(VCC) U14.14(VCC) U34.14(VCC) U40.14(VCC) U41.4(PR) U41.13(CLR) U41.14(VCC) U44.16(VCC)  [also labelled VDD]
~{BLANK}: C49.2 J29.1 U40.8(Y) U41.1(CLR)
BK: J31.1 U7.1(CLK) U8.8(~{Q}) U8.12(D) U13.10(B) U44.6(OE1)
H5: U34.13(A) U41.12(D) ; port H5
~{KS}: J30.2 J31.3 U11.12(A) U41.2(D)
V4: U40.5(C) U44.3(C) ; port V4
V5: U40.4(B) U44.4(~{OE}2A) ; port V5
V6: U12.10(B) U13.9(A) U44.5(~{OE}2B) ; port V6
NetC2_1: C2.1 J31.2
NetC2_2: C2.2 D1.2(K) R23.2 U1.13(A)
NetC10_2: U8.3(CLK) U14.4(A) ; port ~{HCO}
NetC11_1: U8.11(CLK) U12.8(Y) ; port ~{LDV}
NetC12_2: U8.5(Q) ; port ~{BS}
NetD2_2: U7.11(Q0) ; port FLASH
NetD4_2: U11.6(Y) ; port SYNC
NetJ27_1: J27.1 ; port H7
NetJ27_2: J27.2 U40.10(B)
NetJ27_3: J27.3 U34.12(Y)
NetJ28_1: J28.1 U11.4(A) U11.11(Y)
NetJ28_2: J28.2 ; port PORCH
NetJ28_3: J28.3 U41.6(~{Q}) U41.10(PR)
NetJ29_2: J29.2 U11.13(B)
NetJ29_3: J29.3 U41.9(Q)
NetJ30_1: J30.1 U40.6(Y)
NetJ30_3: J30.3 U44.15(~{Y}0)
NetU1_12: U1.12(Y) ; port ~{INT}
NetU4_3: U41.3(CLK) U41.11(CLK) ; port H4
NetU4_6: U34.5(A) ; port H6
NetU4_11: U14.6(Y) ; port ~{LDH}
NetU5_6: U44.1(A) ; port V2
NetU5_7: U44.2(B) ; port V3
NetU5_9: U8.9(Q) ; port ~{BK}
NetU6_7: U12.9(A) ; port V7
NetU7_6: U7.6(Q3) U7.9(CLK)
NetU8_2: U8.2(D) U8.6(~{Q}) U14.5(B) U40.9(A)
NetU13_8: U13.8(Y) U40.3(A)
NetU34_6: U34.6(Y) U40.11(C)

Not connected (* = marked no-connect by the designer): U7 3(Q0) 4(Q1) 5(Q2) 12(Q1) 13(Q2) 14(Q3); U8 4(PR) 10(PR); U41 5(Q) 8(~{Q}); U44 7(~{Y}7) 9(~{Y}6) 10(~{Y}5) 11(~{Y}4) 12(~{Y}3) 13(~{Y}2) 14(~{Y}1)

### Notes on the sheet
- Картинка стабильная, но есть небольшие артефакты
- (near U1) Цепочка INT C2 висит на BK 8-12 U8
- Labels drawn without touching a wire or pin: ~{KS}

### Library data of the parts
C2 C49 C54-C57 = Cap: Capacitor; Published: 8-Jun-2000; LatestRevisionDate: 17-Jul-2002; LatestRevisionNote: Re-released for DXP Platform.; PackageReference: RAD-0.3; Publisher: Altium Limited; PackageDescription: Radial Cap, Thru-Hole; 2 Leads; 0.3 in Pin Spacing
D1 = Diode 1N4148: High Conductance Fast Diode; Published: 8-Jun-2000; LatestRevisionDate: 17-Jul-2002; LatestRevisionNote: Re-released for DXP Platform.; DatasheetVersion: 1997; PackageReference: DO-35; Publisher: Altium Limited; PackageDescription: Diode, Axial; Body 3.8 x 1.9 mm (LxDia. max), Lead Dia. 0.53 mm (max); Code_JEDEC: DO-204-AH; ComponentLink1Description: Manufacturer Link; ComponentLink1URL: http://www.fairchildsemi.com/; ComponentLink2Description: Datasheet; ComponentLink2URL: http://www.fairchildsemi.com/ds/1N%2F1N4148.pdf
R23 = Res2: Resistor; Published: 8-Jun-2000; LatestRevisionDate: 17-Jul-2002; LatestRevisionNote: Re-released for DXP Platform.; PackageReference: AXIAL-0.4; Publisher: Altium Limited; PackageDescription: Axial Device, Thru-Hole; 2 Leads; 0.4 in Pin Spacing
U1 U34 = SN74HC04N: Hex Inverter; Published: 8-Jun-2000; LatestRevisionDate: 04-Mar-2005; LatestRevisionNote: Stylized 3D Model Added.; DatasheetVersion: May-1997; PackageVersion: Oct-1995; PackageReference: N014; Publisher: Altium Limited; PackageDescription: DIP; 14 Leads; Row Spacing 7.62 mm; Pitch 2.54 mm; ComponentLink1Description: Manufacturer Link; ComponentLink1URL: http://www.ti.com/; ComponentLink2Description: Datasheet; ComponentLink2URL: http://www-s.ti.com/sc/ds/sn74hc04.pdf
U7 = MC14520BCP: Dual Binary Up Counter; Published: 15-Apr-2002; DatasheetVersion: 1995; PackageVersion: Apr-2000; PackageReference: 648-08; Publisher: Altium Limited; PackageDescription: DIP; 16 Leads; Row Spacing 7.62 mm; Pitch 2.54 mm; Code_JEDEC: MS-001-BB; ComponentLink1Description: Manufacturer Link; ComponentLink1URL: http://www.onsemi.com/; ComponentLink2Description: Datasheet; ComponentLink2URL: http://www.onsemi.com/pub/Collateral/MC14518B-D.PDF
U8 U41 = SN74HC74N: as U2 on sheet ClockGenerator; Published: 8-Jun-2000; LatestRevisionDate: 04-Mar-2005; LatestRevisionNote: Stylized 3D Model Added.; DatasheetVersion: May-1997; PackageVersion: Oct-1995; PackageReference: N014; Publisher: Altium Limited; PackageDescription: DIP; 14 Leads; Row Spacing 7.62 mm; Pitch 2.54 mm; ComponentLink1Description: Manufacturer Link; ComponentLink1URL: http://www.ti.com/; ComponentLink2Description: Datasheet; ComponentLink2URL: http://www-s.ti.com/sc/ds/sn74hc74.pdf
U11 = SN74HC86N: Quadruple 2-Input Exclusive-OR Gate; Published: 8-Jun-2000; LatestRevisionDate: 04-Mar-2005; LatestRevisionNote: Stylized 3D Model Added.; DatasheetVersion: Aug-1999; PackageVersion: Oct-1995; PackageReference: N014; Publisher: Altium Limited; PackageDescription: DIP; 14 Leads; Row Spacing 7.62 mm; Pitch 2.54 mm; ComponentLink1Description: Manufacturer Link; ComponentLink1URL: http://www.ti.com/; ComponentLink2Description: Datasheet; ComponentLink2URL: http://www-s.ti.com/sc/ds/SN54HC86.pdf
U12 = SN74HC00N: Quadruple 2-Input Positive-NAND Gate; Published: 8-Jun-2000; LatestRevisionDate: 04-Mar-2005; LatestRevisionNote: Stylized 3D Model Added.; DatasheetVersion: May-1997; PackageVersion: Oct-1995; PackageReference: N014; Publisher: Altium Limited; PackageDescription: DIP; 14 Leads; Row Spacing 7.62 mm; Pitch 2.54 mm; ComponentLink1Description: Manufacturer Link; ComponentLink1URL: http://www.ti.com/; ComponentLink2Description: Datasheet; ComponentLink2URL: http://www-s.ti.com/sc/ds/sn74hc00.pdf
U13 = SN74HC08N: Quadruple 2-Input Positive-AND Gate; Published: 8-Jun-2000; LatestRevisionDate: 04-Mar-2005; LatestRevisionNote: Stylized 3D Model Added.; DatasheetVersion: May-1997; PackageVersion: Oct-1995; PackageReference: N014; Publisher: Altium Limited; PackageDescription: DIP; 14 Leads; Row Spacing 7.62 mm; Pitch 2.54 mm; ComponentLink1Description: Manufacturer Link; ComponentLink1URL: http://www.ti.com/; ComponentLink2Description: Datasheet; ComponentLink2URL: http://www-s.ti.com/sc/ds/SN74HC08.pdf
U14 = SN74HC32N: Quadruple 2-Input Positive-OR Gate; Published: 8-Jun-2000; LatestRevisionDate: 04-Mar-2005; LatestRevisionNote: Stylized 3D Model Added.; DatasheetVersion: May-1997; PackageVersion: Oct-1995; PackageReference: N014; Publisher: Altium Limited; PackageDescription: DIP; 14 Leads; Row Spacing 7.62 mm; Pitch 2.54 mm; ComponentLink1Description: Manufacturer Link; ComponentLink1URL: http://www.ti.com/; ComponentLink2Description: Datasheet; ComponentLink2URL: http://www-s.ti.com/sc/ds/sn74hc32.pdf
U40 = SN74HC10N: Triple 3-Input Positive-NAND Gate; Published: 8-Jun-2000; LatestRevisionDate: 04-Mar-2005; LatestRevisionNote: Stylized 3D Model Added.; DatasheetVersion: May-1997; PackageVersion: Oct-1995; PackageReference: N014; Publisher: Altium Limited; PackageDescription: DIP; 14 Leads; Row Spacing 7.62 mm; Pitch 2.54 mm; ComponentLink1Description: Manufacturer Link; ComponentLink1URL: http://www.ti.com/; ComponentLink2Description: Datasheet; ComponentLink2URL: http://www-s.ti.com/sc/ds/sn74hc10.pdf
U44 = SN74HC138N: 3-Line to 8-Line Decoder / Demultiplexer; Published: 8-Jun-2000; LatestRevisionDate: 04-Mar-2005; LatestRevisionNote: Stylized 3D Model Added.; DatasheetVersion: May-1997; PackageVersion: Oct-1995; PackageReference: N016; Publisher: Altium Limited; PackageDescription: DIP; 16 Leads; Row Spacing 7.62 mm; Pitch 2.54 mm; ComponentLink1Description: Manufacturer Link; ComponentLink1URL: http://www.ti.com/; ComponentLink2Description: Datasheet; ComponentLink2URL: http://www-s.ti.com/sc/ds/sn74hc138.pdf; Code_JEDEC: MS-001-BB

## Sheet VideoSignal.SchDoc
size A4
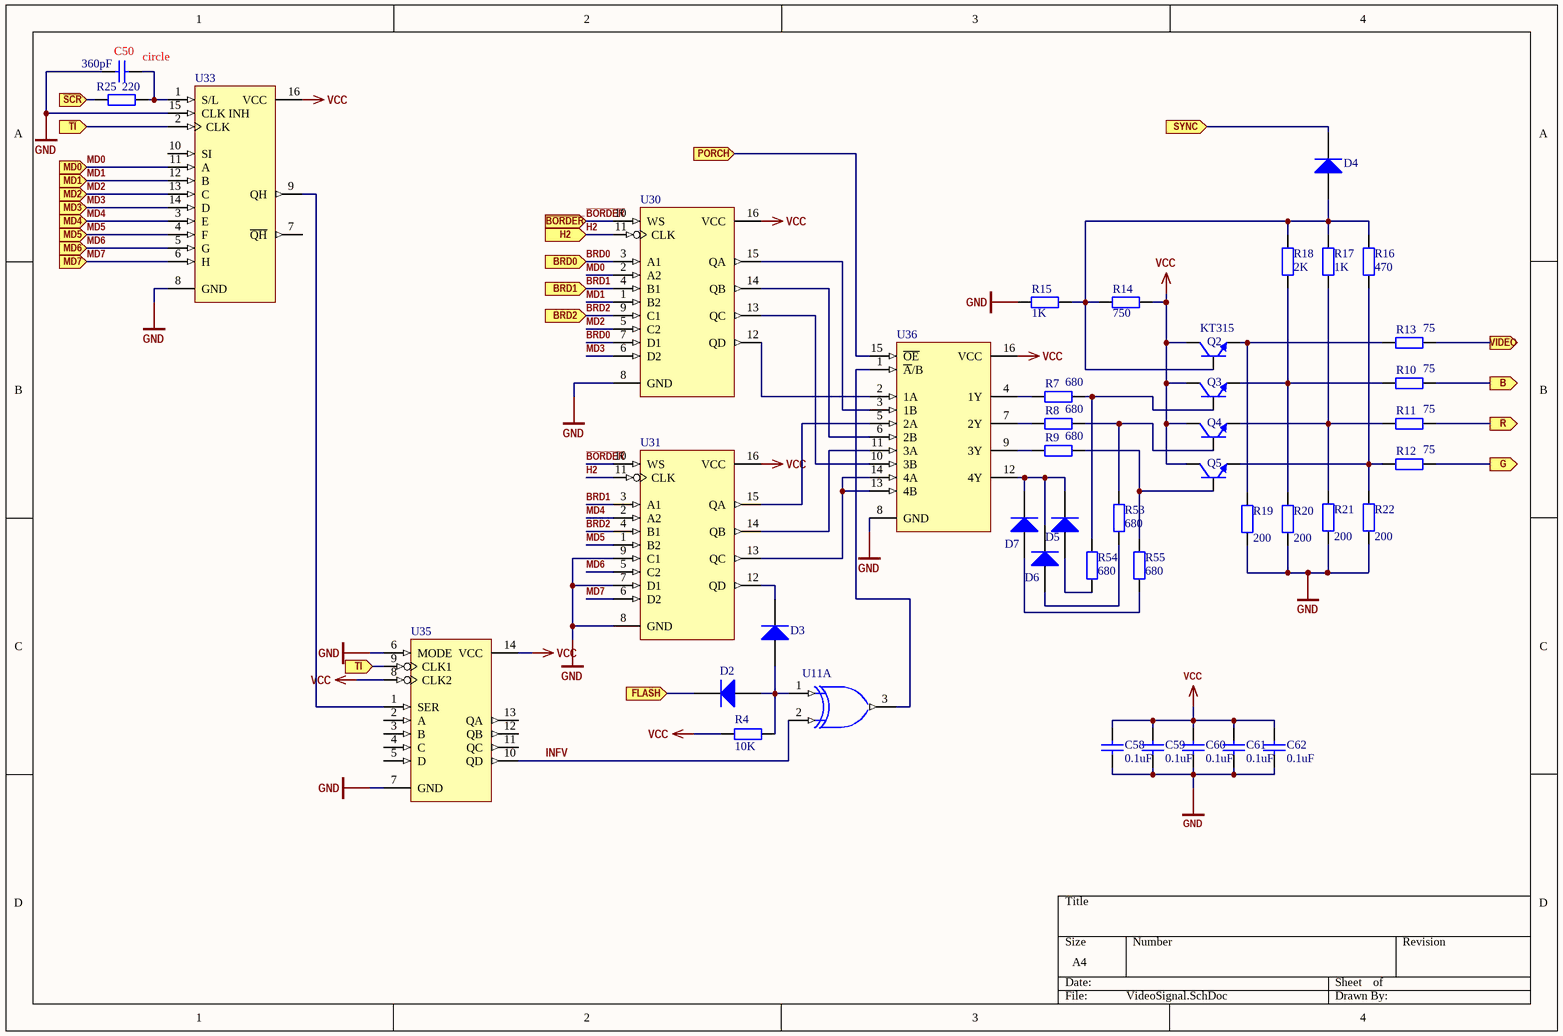
[diagram p4: VideoSignal.SchDoc]

### Parts
C50  circle  value 360pF  [RAD-0.3]
C58  value 0.1uF  [RAD-0.3]  (hidden comment: Cap)
C59  value 0.1uF  [RAD-0.3]  (hidden comment: Cap)
C60  value 0.1uF  [RAD-0.3]  (hidden comment: Cap)
C61  value 0.1uF  [RAD-0.3]  (hidden comment: Cap)
C62  value 0.1uF  [RAD-0.3]  (hidden comment: Cap)
D2  (no value)  [DO-35A]
D3  (no value)  [DO-35A]
D4  Diode 1N4148  [DO-35]  (value not drawn)
D5  Diode 1N4148  [DO-35]  (value not drawn)
D6  Diode 1N4148  [DO-35]  (value not drawn)
D7  Diode 1N4148  [DO-35]  (value not drawn)
Q2  KT315  [D35]
Q3  KT315  [D35]  (value not drawn)
Q4  KT315  [D35]  (value not drawn)
Q5  KT315  [D35]  (value not drawn)
R4  value 10K  [AXIAL-0.4]
R7  value 680  [AXIAL-0.4]
R8  value 680  [AXIAL-0.4]
R9  value 680  [AXIAL-0.4]
R10  value 75  [AXIAL-0.4]
R11  value 75  [AXIAL-0.4]
R12  value 75  [AXIAL-0.4]
R13  value 75  [AXIAL-0.4]
R14  value 750  [AXIAL-0.4]
R15  value 1K  [AXIAL-0.4]
R16  value 470  [AXIAL-0.4]
R17  value 1K  [AXIAL-0.4]
R18  value 2K  [AXIAL-0.4]
R19  value 200  [AXIAL-0.4]
R20  value 200  [AXIAL-0.4]
R21  value 200  [AXIAL-0.4]
R22  value 200  [AXIAL-0.4]
R25  value 220  [AXIAL-0.4]
R53  value 680  [AXIAL-0.4]  (hidden comment: Res2)
R54  value 680  [AXIAL-0.4]  (hidden comment: Res2)
R55  value 680  [AXIAL-0.4]  (hidden comment: Res2)
U11  (no value)  [N014]  (part A of 4)
U30  (no value)  [N016D]
U31  (no value)  [N016D]
U33  (no value)  [N016]
U35  (no value)  [N014]
U36  (no value)  [N016]

### Ports
B (out), BRD0 (in), BRD1 (in), BRD2 (in), FLASH (in), G (out), H2 (in), MD0 (in), MD1 (in), MD2 (in), MD3 (in), MD4 (in), MD5 (in), MD6 (in), MD7 (in), PORCH (in), R (out), SYNC (in), TI (in), VIDEO (out), ~{BORDER} (in), ~{SCR} (in), ~{TI} (in)

### Nets
GND: C50.2 C58.1 C59.1 C60.1 C61.1 C62.1 R15.1 R19.1 R20.1 R21.1 R22.1 U11.7(GND) U30.8(GND) U31.7(D1) U31.8(GND) U31.9(C1) U33.8(GND) U33.15(CLK_INH) U35.6(MODE) U35.7(GND) U36.8(GND)
VCC: C58.2 C59.2 C60.2 C61.2 C62.2 Q2.2(C) Q3.2(C) Q4.2(C) Q5.2(C) R4.1 R14.2 U11.14(VCC) U30.16(VCC) U31.16(VCC) U33.16(VCC) U35.8(CLK2) U35.14(VCC) U36.16(VCC)
~{BORDER}: U30.10(WS) U31.10(WS) ; port ~{BORDER}
BRD0: U30.3(A1) U30.7(D1) ; port BRD0
BRD1: U30.4(B1) U31.3(A1) ; port BRD1
BRD2: U30.9(C1) U31.4(B1) ; port BRD2
H2: U30.11(CLK) U31.11(CLK) ; port H2
INFV: U11.2(B) U35.10(QD)
MD0: U30.2(A2) U33.11(A) ; port MD0
MD1: U30.1(B2) U33.12(B) ; port MD1
MD2: U30.5(C2) U33.13(C) ; port MD2
MD3: U30.6(D2) U33.14(D) ; port MD3
MD4: U31.2(A2) U33.3(E) ; port MD4
MD5: U31.1(B2) U33.4(F) ; port MD5
MD6: U31.5(C2) U33.5(G) ; port MD6
MD7: U31.6(D2) U33.6(H) ; port MD7
NetB_1: R10.2 ; port B
NetC50_1: C50.1 R25.1 U33.1(S/L)
NetD2_1: D2.1(A) D3.1(A) R4.2 U11.1(A)
NetD2_2: D2.2(K) ; port FLASH
NetD3_2: D3.2(K) U31.12(QD)
NetD4_1: D4.1(A) Q2.3(B) R14.1 R15.2 R16.2 R17.2 R18.2
NetD4_2: D4.2(K) ; port SYNC
NetD5_1: D5.1(A) R54.1
NetD5_2: D5.2(K) D6.2(K) D7.2(K) U36.12(4Y)
NetD6_1: D6.1(A) R53.1
NetD7_1: D7.1(A) R55.1
NetG_1: R12.2 ; port G
NetJ8_3: R13.2 ; port VIDEO
NetJ28_2: U36.15(~{OE}) ; port PORCH
NetQ2_1: Q2.1(E) R13.1 R19.2
NetQ3_1: Q3.1(E) R10.1 R18.1 R20.2
NetQ3_3: Q3.3(B) R7.2 R54.2
NetQ4_1: Q4.1(E) R11.1 R17.1 R21.2
NetQ4_3: Q4.3(B) R8.2 R53.2
NetQ5_1: Q5.1(E) R12.1 R16.1 R22.2
NetQ5_3: Q5.3(B) R9.2 R55.2
NetR7_1: R7.1 U36.4(1Y)
NetR8_1: R8.1 U36.7(2Y)
NetR9_1: R9.1 U36.9(3Y)
NetR25_2: R25.2 ; port ~{SCR}
NetR_1: R11.2 ; port R
NetU2_2: U33.2(CLK) ; port ~{TI}
NetU2_5: U35.9(CLK1) ; port TI
NetU11_3: U11.3(Y) U36.1(~{A}/B)
NetU30_12: U30.12(QD) U36.2(1A)
NetU30_13: U30.13(QC) U36.10(3B)
NetU30_14: U30.14(QB) U36.6(2B)
NetU30_15: U30.15(QA) U36.3(1B)
NetU31_13: U31.13(QC) U36.13(4B) U36.14(4A)
NetU31_14: U31.14(QB) U36.11(3A)
NetU31_15: U31.15(QA) U36.5(2A)
NetU33_9: U33.9(QH) U35.1(SER)

Not connected (* = marked no-connect by the designer): U33 7(~{QH}) 10(SI); U35 2(A) 3(B) 4(C) 5(D) 11(QC) 12(QB) 13(QA)

### Library data of the parts
C50 C58-C62 = Cap: Capacitor; Published: 8-Jun-2000; LatestRevisionDate: 17-Jul-2002; LatestRevisionNote: Re-released for DXP Platform.; PackageReference: RAD-0.3; Publisher: Altium Limited; PackageDescription: Radial Cap, Thru-Hole; 2 Leads; 0.3 in Pin Spacing
D2 D3 = Diode 1N4149: Computer Diode; Published: 8-Jun-2000; LatestRevisionDate: 17-Jul-2002; LatestRevisionNote: Re-released for DXP Platform.; DatasheetVersion: 1989; PackageReference: DO-35A; Publisher: Altium Limited; PackageDescription: Diode, Axial; Body 4.6 x 1.9 mm (LxDia. max), Lead Dia. 0.53 mm (max); Code_JEDEC: DO-204-AH; ComponentLink1Description: Manufacturer Link; ComponentLink1URL: http://www.national.com/; PackageVersion: 1989
D4-D7 = Diode 1N4148: High Conductance Fast Diode; Published: 8-Jun-2000; LatestRevisionDate: 17-Jul-2002; LatestRevisionNote: Re-released for DXP Platform.; DatasheetVersion: 1997; PackageReference: DO-35; Publisher: Altium Limited; PackageDescription: Diode, Axial; Body 3.8 x 1.9 mm (LxDia. max), Lead Dia. 0.53 mm (max); Code_JEDEC: DO-204-AH; ComponentLink1Description: Manufacturer Link; ComponentLink1URL: http://www.fairchildsemi.com/; ComponentLink2Description: Datasheet; ComponentLink2URL: http://www.fairchildsemi.com/ds/1N%2F1N4148.pdf
Q2-Q5 = KT315: NPN General Purpose Amplifier; Published: 8-Jun-2000; LatestRevisionDate: 15-Jan-2003; LatestRevisionNote: PCB Footprint 'BCY-W3/D4.7' replaced; DatasheetVersion: 1997; PackageVersion: Sep-1998; PackageReference: TO-92A; Publisher: Altium Limited; PackageDescription: TO, Flat Index; 3 In-Line, Axial Leads; Body Dia. 4.5mm; Leads 0.51 x 0.48 mm (max); ComponentLink1Description: Manufacturer Link; ComponentLink1URL: http://www.fairchildsemi.com/; ComponentLink2Description: Datasheet; ComponentLink2URL: http://www.fairchildsemi.com/ds/2N%2F2N3904.pdf
R4 R7-R22 R25 R53-R55 = Res2: Resistor; Published: 8-Jun-2000; LatestRevisionDate: 17-Jul-2002; LatestRevisionNote: Re-released for DXP Platform.; PackageReference: AXIAL-0.4; Publisher: Altium Limited; PackageDescription: Axial Device, Thru-Hole; 2 Leads; 0.4 in Pin Spacing
U11 = SN74HC86N: Quadruple 2-Input Exclusive-OR Gate; Published: 8-Jun-2000; LatestRevisionDate: 04-Mar-2005; LatestRevisionNote: Stylized 3D Model Added.; DatasheetVersion: Aug-1999; PackageVersion: Oct-1995; PackageReference: N014; Publisher: Altium Limited; PackageDescription: DIP; 14 Leads; Row Spacing 7.62 mm; Pitch 2.54 mm; ComponentLink1Description: Manufacturer Link; ComponentLink1URL: http://www.ti.com/; ComponentLink2Description: Datasheet; ComponentLink2URL: http://www-s.ti.com/sc/ds/SN54HC86.pdf
U30 U31 = SN74HC298N: Quadruple 2-Input Multiplexer with Storage; Published: 8-Jun-2000; LatestRevisionDate: 04-Mar-2005; LatestRevisionNote: Stylized 3D Model Added.; DatasheetVersion: Jun-1989; PackageVersion: Oct-1995; PackageReference: N016D; Publisher: Altium Limited; PackageDescription: DIP; 16 Leads; Row Spacing 7.62 mm; Pitch 2.54 mm; Code_JEDEC: MS-001-BB; ComponentLink1Description: Manufacturer Link; ComponentLink1URL: http://www.ti.com/
U33 = SN74HC165N: 8-Bit Parallel-Load Shift Register; Published: 8-Jun-2000; LatestRevisionDate: 04-Mar-2005; LatestRevisionNote: Stylized 3D Model Added.; DatasheetVersion: May-1997; PackageVersion: Oct-1995; PackageReference: N016; Publisher: Altium Limited; PackageDescription: DIP; 16 Leads; Row Spacing 7.62 mm; Pitch 2.54 mm; Code_JEDEC: MS-001-BB; ComponentLink1Description: Manufacturer Link; ComponentLink1URL: http://www.ti.com/; ComponentLink2Description: Datasheet; ComponentLink2URL: http://www-s.ti.com/sc/ds/sn74hc165.pdf
U35 = SN74LS95BN: 4-Bit Parallel-Access Shift Register; ComponentAvailability: Obsolete; Published: 8-Jun-2000; LatestRevisionDate: 04-Mar-2005; LatestRevisionNote: Stylized 3D Model Added.; DatasheetVersion: Mar-1988; PackageVersion: Oct-1995; PackageReference: N014; Publisher: Altium Limited; PackageDescription: DIP; 14 Leads; Row Spacing 7.62 mm; Pitch 2.54 mm; ComponentLink1Description: Manufacturer Link; ComponentLink1URL: http://www.ti.com/; ComponentLink2Description: Datasheet; ComponentLink2URL: http://www-s.ti.com/sc/ds/sn5495a.pdf
U36 = SN74HC257N: Quadruple 2-Line to 1-Line Data Selector/Multiplexer with 3-State Outputs; Published: 8-Jun-2000; LatestRevisionDate: 04-Mar-2005; LatestRevisionNote: Stylized 3D Model Added.; DatasheetVersion: Jun-1989; PackageVersion: Oct-1995; PackageReference: N016; Publisher: Altium Limited; PackageDescription: DIP; 16 Leads; Row Spacing 7.62 mm; Pitch 2.54 mm; Code_JEDEC: MS-001-BB; ComponentLink1Description: Manufacturer Link; ComponentLink1URL: http://www.ti.com/; ComponentLink2Description: Datasheet; ComponentLink2URL: http://www-s.ti.com/sc/ds/sn74hc257.pdf

## Sheet CPU_ROM.SchDoc
size A4
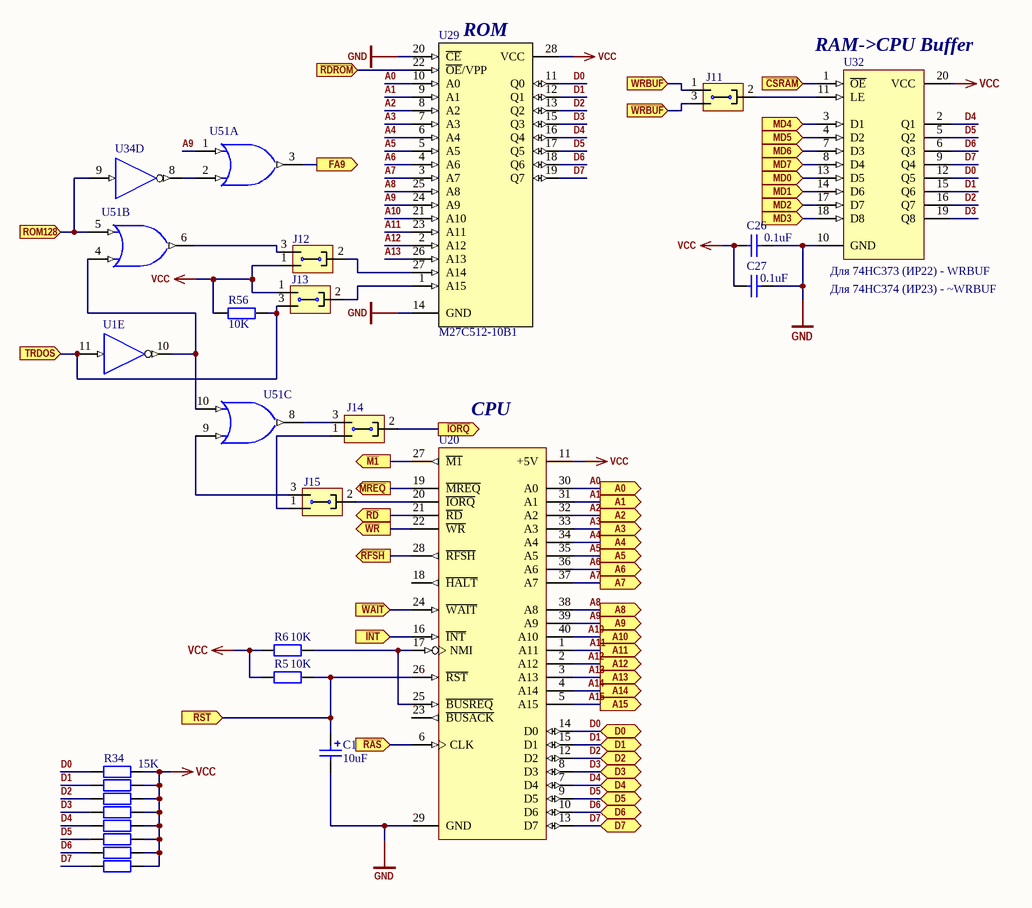
[diagram p5: CPU_ROM.SchDoc]

### Parts
C1  value 10uF  [JRB-5D]  (hidden comment: Cap Pol1)
C26  value 0.1uF  [RAD-0.3]  (hidden comment: Cap)
C27  value 0.1uF  [RAD-0.3]  (hidden comment: Cap)
J11  Jump3  [MHDR1X3]  (value not drawn)
J12  Jump3  [MHDR1X3]  (value not drawn)
J13  Jump3  [MHDR1X3]  (value not drawn)
J14  Jump3  [MHDR1X3]  (value not drawn)
J15  Jump3  [MHDR1X3]  (value not drawn)
R5  value 10K  [AXIAL-0.4]
R6  value 10K  [AXIAL-0.4]
R34  value 15K  [AXIAL-0.4]
R35  (no value)  [AXIAL-0.4]
R37  (no value)  [AXIAL-0.4]
R39  (no value)  [AXIAL-0.4]
R41  (no value)  [AXIAL-0.4]
R43  (no value)  [AXIAL-0.4]
R47  (no value)  [AXIAL-0.4]
R48  (no value)  [AXIAL-0.4]
R56  value 10K  [AXIAL-0.4]
U1  (no value)  [N014]  (part E of 6)
U20  Z84C0004PEC  [PDIP40]  (value not drawn)
U29  M27C512-10B1  [PDIP28]
U32  (no value)  [N020]
U34  (no value)  [N014]  (part D of 6)
U51  SN74HC32N  [N014]  (value not drawn)  (parts A,B,C of 4)

### Ports
A0 (out), A1 (out), A2 (out), A3 (out), A4 (out), A5 (out), A6 (out), A7 (out), A8 (out), A9 (out), A10 (out), A11 (out), A12 (out), A13 (out), A14 (out), A15 (out), D0 (bidir), D1 (bidir), D2 (bidir), D3 (bidir), D4 (bidir), D5 (bidir), D6 (bidir), D7 (bidir), FA9 (out), MD0 (in), MD1 (in), MD2 (in), MD3 (in), MD4 (in), MD5 (in), MD6 (in), MD7 (in), ROM128 (in), TRDOS (in), WRBUF (in), ~{CSRAM} (in), ~{INT} (in), ~{IORQ} (out), ~{M1} (out), ~{MREQ} (out), ~{RAS} (in), ~{RDROM} (in), ~{RD} (out), ~{RFSH} (out), ~{RST} (in), ~{WAIT} (in), ~{WRBUF} (in), ~{WR} (out)

### Nets
GND: C1.2 C26.2 C27.2 U1.7(GND) U20.29(GND) U29.14(GND) U29.20(~{CE}) U32.10(GND) U34.7(GND) U51.7(GND)
VCC: C26.1 C27.1 J12.1 J13.1 R5.1 R6.2 R34.2 R35.2 R37.2 R39.2 R41.2 R43.2 R47.2 R48.2 R56.1 U1.14(VCC) U20.11(+5V) U29.28(VCC) U32.20(VCC) U34.14(VCC) U51.14(VCC)
A0: U20.30(A0) U29.10(A0) ; port A0
A1: U20.31(A1) U29.9(A1) ; port A1
A2: U20.32(A2) U29.8(A2) ; port A2
A3: U20.33(A3) U29.7(A3) ; port A3
A4: U20.34(A4) U29.6(A4) ; port A4
A5: U20.35(A5) U29.5(A5) ; port A5
A6: U20.36(A6) U29.4(A6) ; port A6
A7: U20.37(A7) U29.3(A7) ; port A7
A8: U20.38(A8) U29.25(A8) ; port A8
A9: U20.39(A9) U29.24(A9) U51.1(A) ; port A9
A10: U20.40(A10) U29.21(A10) ; port A10
A11: U20.1(A11) U29.23(A11) ; port A11
A12: U20.2(A12) U29.2(A12) ; port A12
A13: U20.3(A13) U29.26(A13) ; port A13
A14: U20.4(A14) ; port A14
A15: U20.5(A15) ; port A15
D0: R34.1 U20.14(D0) U29.11(Q0) U32.12(Q5) ; port D0
D1: R35.1 U20.15(D1) U29.12(Q1) U32.15(Q6) ; port D1
D2: R37.1 U20.12(D2) U29.13(Q2) U32.16(Q7) ; port D2
D3: R39.1 U20.8(D3) U29.15(Q3) U32.19(Q8) ; port D3
D4: R41.1 U20.7(D4) U29.16(Q4) U32.2(Q1) ; port D4
D5: R43.1 U20.9(D5) U29.17(Q5) U32.5(Q2) ; port D5
D6: R47.1 U20.10(D6) U29.18(Q6) U32.6(Q3) ; port D6
D7: R48.1 U20.13(D7) U29.19(Q7) U32.9(Q4) ; port D7
~{MREQ}: U20.19(~{MREQ}) ; port ~{MREQ}
MD0: U32.13(D5) ; port MD0
MD1: U32.14(D6) ; port MD1
MD2: U32.17(D7) ; port MD2
MD3: U32.18(D8) ; port MD3
MD4: U32.3(D1) ; port MD4
MD5: U32.4(D2) ; port MD5
MD6: U32.7(D3) ; port MD6
MD7: U32.8(D4) ; port MD7
~{RAS}: U20.6(CLK) ; port ~{RAS}
~{RD}: U20.21(~{RD}) ; port ~{RD}
~{WR}: U20.22(~{WR}) ; port ~{WR}
~{WRBUF}: J11.3 ; port ~{WRBUF}
NetC1_1: C1.1 R5.2 U20.26(~{RST}) ; port ~{RST}
NetJ11_1: J11.1 ; port WRBUF
NetJ11_2: J11.2 U32.11(LE)
NetJ12_2: J12.2 U29.27(A14)
NetJ12_3: J12.3 U51.6(Y)
NetJ13_2: J13.2 U29.1(A15)
NetJ13_3: J13.3 R56.2 U1.11(A) ; port TRDOS
NetJ14_1: J14.1 J15.1
NetJ14_2: J14.2 ; port ~{IORQ}
NetJ14_3: J14.3 U51.8(Y)
NetJ15_2: J15.2 U20.20(~{IORQ})
NetJ15_3: J15.3 U51.9(A)
NetR6_1: R6.1 U20.17(NMI) U20.25(~{BUSREQ})
NetU1_9: U32.1(~{OE}) ; port ~{CSRAM}
NetU1_10: U1.10(Y) U51.4(A) U51.10(B)
NetU1_12: U20.16(~{INT}) ; port ~{INT}
NetU9_2: U20.27(~{M1}) ; port ~{M1}
NetU9_5: U20.24(~{WAIT}) ; port ~{WAIT}
NetU12_3: U29.22(~{OE}/VPP) ; port ~{RDROM}
NetU12_13: U20.28(~{RFSH}) ; port ~{RFSH}
NetU34_8: U34.8(Y) U51.2(B)
NetU34_9: U34.9(A) U51.5(B) ; port ROM128
NetU51_3: U51.3(Y) ; port FA9

Not connected (* = marked no-connect by the designer): U20 18(~{HALT}) 23(~{BUSACK})

### Notes on the sheet
- (near U29) ROM
- (near U32) RAM->CPU Buffer
- (near U32) Для 74HC373 (ИР22) - WRBUF
- (near U32) Для 74HC374 (ИР23) - ~WRBUF
- (near U20) CPU

### Library data of the parts
C1 = Cap Pol1: Polarized Capacitor (Radial); Published: 8-Jun-2000; LatestRevisionDate: 17-Jul-2002; LatestRevisionNote: Re-released for DXP Platform.; PackageReference: RB7.6-15; Publisher: Altium Limited; PackageDescription: Polarized Capacitor (Radial); 2 Leads
C26 C27 = Cap: Capacitor; Published: 8-Jun-2000; LatestRevisionDate: 17-Jul-2002; LatestRevisionNote: Re-released for DXP Platform.; PackageReference: RAD-0.3; Publisher: Altium Limited; PackageDescription: Radial Cap, Thru-Hole; 2 Leads; 0.3 in Pin Spacing
R5 R6 R34 R56 = Res2: Resistor; Published: 8-Jun-2000; LatestRevisionDate: 17-Jul-2002; LatestRevisionNote: Re-released for DXP Platform.; PackageReference: AXIAL-0.4; Publisher: Altium Limited; PackageDescription: Axial Device, Thru-Hole; 2 Leads; 0.4 in Pin Spacing
R35 R37 R39 R41 R43 R47 R48 = Res2: Resistor; Value: 15K; Published: 8-Jun-2000; LatestRevisionDate: 17-Jul-2002; LatestRevisionNote: Re-released for DXP Platform.; PackageReference: AXIAL-0.4; Publisher: Altium Limited; PackageDescription: Axial Device, Thru-Hole; 2 Leads; 0.4 in Pin Spacing
U1 U34 = SN74HC04N: Hex Inverter; Published: 8-Jun-2000; LatestRevisionDate: 04-Mar-2005; LatestRevisionNote: Stylized 3D Model Added.; DatasheetVersion: May-1997; PackageVersion: Oct-1995; PackageReference: N014; Publisher: Altium Limited; PackageDescription: DIP; 14 Leads; Row Spacing 7.62 mm; Pitch 2.54 mm; ComponentLink1Description: Manufacturer Link; ComponentLink1URL: http://www.ti.com/; ComponentLink2Description: Datasheet; ComponentLink2URL: http://www-s.ti.com/sc/ds/sn74hc04.pdf
U20 = Z84C0004PEC: CMOS 8-Bit Microprocessor; Published: 15-Apr-2002; LatestRevisionDate: 04-Mar-2005; LatestRevisionNote: Stylized 3D Model Added.; DatasheetVersion: Jan-1989; PackageVersion: Jun-1999; PackageReference: PDIP40; Publisher: Altium Limited; PackageDescription: DIP; 40 Leads; Row Spacing 15.24 mm; Pitch 2.54 mm; ComponentLink1Description: Manufacturer Link; ComponentLink1URL: http://www.zilog.com/
U29 = M27C512-10B1: 512 Kbit (64Kb x 8) UV EPROM and OTP EPROM; Published: 24-Aug-2001; LatestRevisionDate: 06-Jun-2005; LatestRevisionNote: Stylized 3D Model Added.; DatasheetVersion: Nov-1998; PackageVersion: Jan-2003; PackageReference: PDIP28; Publisher: Altium Limited; PackageDescription: DIP; 28 Leads; Row Spacing 15.24 mm; Pitch 2.54 mm; ComponentLink1Description: Manufacturer Link; ComponentLink1URL: http://www.st.com/; ComponentLink2Description: Datasheet; ComponentLink2URL: http://www.st.com/stonline/products/literature/ds/2387/m27c512.pdf
U32 = SN74HC373N: Octal Transparent D-Type Latches with 3-State Outputs; Published: 8-Jun-2000; LatestRevisionDate: 04-Mar-2005; LatestRevisionNote: Stylized 3D Model Added.; DatasheetVersion: May-1997; PackageVersion: Oct-1995; PackageReference: N020; Publisher: Altium Limited; PackageDescription: DIP; 20 Leads; Row Spacing 7.62 mm; Pitch 2.54 mm; ComponentLink1Description: Manufacturer Link; ComponentLink1URL: http://www.ti.com/; ComponentLink2Description: Datasheet; ComponentLink2URL: http://www-s.ti.com/sc/ds/sn54hc373.pdf
U51 = SN74HC32N: Quadruple 2-Input Positive-OR Gate; Published: 8-Jun-2000; LatestRevisionDate: 04-Mar-2005; LatestRevisionNote: Stylized 3D Model Added.; DatasheetVersion: May-1997; PackageVersion: Oct-1995; PackageReference: N014; Publisher: Altium Limited; PackageDescription: DIP; 14 Leads; Row Spacing 7.62 mm; Pitch 2.54 mm; ComponentLink1Description: Manufacturer Link; ComponentLink1URL: http://www.ti.com/; ComponentLink2Description: Datasheet; ComponentLink2URL: http://www-s.ti.com/sc/ds/sn74hc32.pdf